# Altium project SNES TST Main.PrjPcb (part 1 of 2)
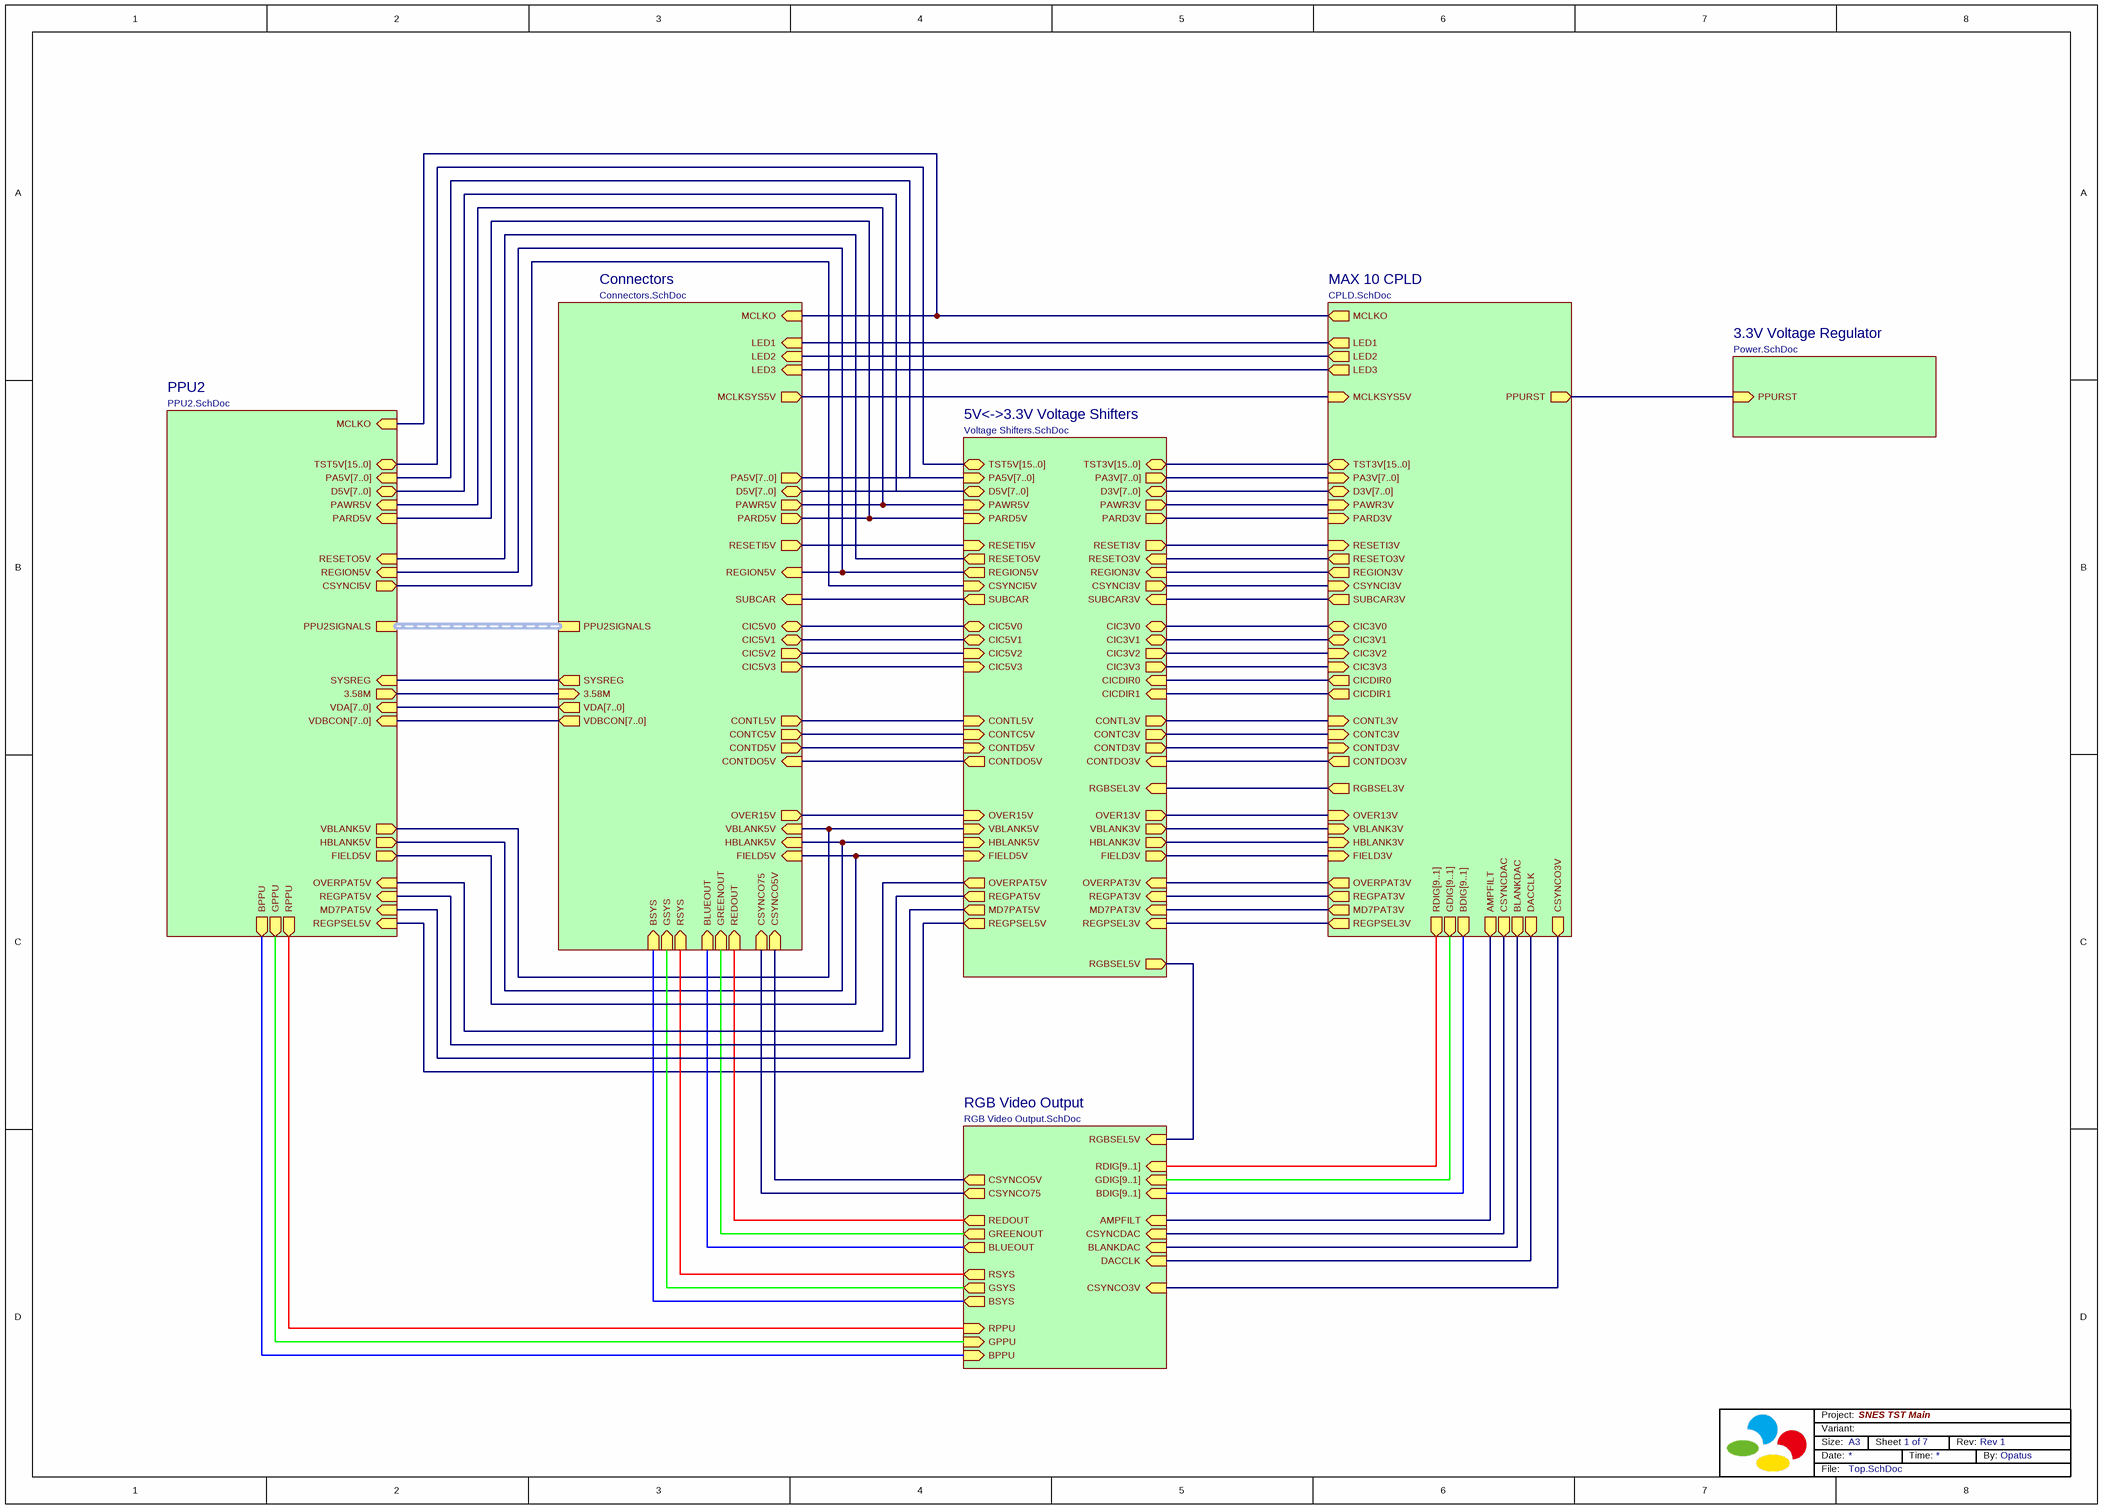
[diagram p0: Top.SchDoc]
DrawnBy: Opatus; Revision: Rev 1; Title: SNES TST Main
7 sheets, 203 parts. Net scope: hierarchical (ports join the sheet entries above them; power ports are global).
Board file: SNES TST Main.PcbDoc
Sheets:
  Top.SchDoc
    MAX 10 CPLD = CPLD.SchDoc
    3.3V Voltage Regulator = Power.SchDoc
    PPU2 = PPU2.SchDoc
    RGB Video Output = RGB Video Output.SchDoc
    5V<->3.3V Voltage Shifters = Voltage Shifters.SchDoc
    Connectors = Connectors.SchDoc

## Sheet Top.SchDoc: SNES TST Main
size A3; SheetNumber: 1; SheetTotal: 7

### Sub-sheets
3.3V Voltage Regulator = Power.SchDoc: PPURST (in)
5V<->3.3V Voltage Shifters = Voltage Shifters.SchDoc: TST5V[15..0] (bidir), D3V[7..0] (bidir), TST3V[15..0] (bidir), CSYNCI5V (in), CSYNCI3V (out), RESETI5V (in), D5V[7..0] (bidir), REGION5V (out), RESETO5V (out), RGBSEL3V (in), PA5V[7..0] (in), PA3V[7..0] (out), SUBCAR (out), RESETO3V (in), RESETI3V (out), SUBCAR3V (in), PARD3V (out), PAWR3V (out), PAWR5V (in), PARD5V (in), REGION3V (in), RGBSEL5V (out), CONTL3V (out), CONTC3V (out), CONTDO3V (in), CONTD3V (out), CIC5V3 (in), CIC5V0 (bidir), CIC5V2 (in), CIC5V1 (bidir), CIC3V3 (out), CIC3V2 (out), CIC3V0 (bidir), CIC3V1 (bidir), CICDIR1 (in), CICDIR0 (in), CONTC5V (in), CONTDO5V (out), CONTL5V (in), CONTD5V (in), OVER15V (in), FIELD5V (in), OVER13V (out), FIELD3V (out), REGPAT3V (in), REGPSEL3V (in), MD7PAT3V (in), OVERPAT3V (in), HBLANK3V (out), VBLANK3V (out), REGPAT5V (out), MD7PAT5V (out), OVERPAT5V (out), REGPSEL5V (out), VBLANK5V (in), HBLANK5V (in)
Connectors = Connectors.SchDoc: SUBCAR (in), OVER15V (out), RESETI5V (out), MCLKO (in), PPU2SIGNALS (harness PPU2), FIELD5V (in), REGION5V (in), VDBCON[7..0] (out), VDA[7..0] (out), SYSREG (out), 3.58M (in), PAWR5V (out), PARD5V (out), PA5V[7..0] (out), D5V[7..0] (bidir), MCLKSYS5V (out), LED1 (in), LED2 (in), LED3 (in), CONTL5V (out), CONTC5V (out), CONTD5V (out), CONTDO5V (in), CIC5V2 (out), CIC5V3 (out), CIC5V0 (bidir), CIC5V1 (bidir), VBLANK5V (in), HBLANK5V (in), RSYS (in), GSYS (in), BSYS (in), CSYNCO5V (in), CSYNCO75 (in), REDOUT (in), GREENOUT (in), BLUEOUT (in)
MAX 10 CPLD = CPLD.SchDoc: BDIG[9..1] (out), TST3V[15..0] (bidir), PA3V[7..0] (in), RESETI3V (in), DACCLK (out), AMPFILT (out), RESETO3V (out), MCLKO (out), CSYNCO3V (out), CSYNCDAC (out), BLANKDAC (out), CSYNCI3V (in), PAWR3V (in), PARD3V (in), PPURST (out), REGION3V (out), D3V[7..0] (bidir), GDIG[9..1] (out), RDIG[9..1] (out), SUBCAR3V (out), LED2 (out), LED3 (out), LED1 (out), MCLKSYS5V (in), VBLANK3V (in), HBLANK3V (in), FIELD3V (in), CIC3V0 (bidir), RGBSEL3V (out), CONTL3V (in), CONTC3V (in), CONTDO3V (out), CONTD3V (in), CICDIR1 (out), CICDIR0 (out), CIC3V1 (bidir), CIC3V3 (in), CIC3V2 (in), OVER13V (in), OVERPAT3V (out), MD7PAT3V (out), REGPSEL3V (out), REGPAT3V (out)
PPU2 = PPU2.SchDoc: CSYNCI5V (out), RESETO5V (in), TST5V[15..0] (bidir), RPPU (out), GPPU (out), BPPU (out), PPU2SIGNALS (harness PPU2), MCLKO (in), REGION5V (in), REGPSEL5V (in), REGPAT5V (in), OVERPAT5V (in), MD7PAT5V (in), VBLANK5V (out), HBLANK5V (out), FIELD5V (out), VDA[7..0] (in), SYSREG (in), VDBCON[7..0] (in), 3.58M (out), PAWR5V (in), PARD5V (in), PA5V[7..0] (in), D5V[7..0] (bidir)
RGB Video Output = RGB Video Output.SchDoc: GDIG[9..1] (in), BDIG[9..1] (in), RDIG[9..1] (in), AMPFILT (in), CSYNCDAC (in), BLANKDAC (in), DACCLK (in), CSYNCO3V (in), RGBSEL5V (in), CSYNCO75 (out), RPPU (in), GPPU (in), BPPU (in), CSYNCO5V (out), RSYS (out), GSYS (out), BSYS (out), GREENOUT (out), REDOUT (out), BLUEOUT (out)

### Nets
3.58M: sheet PPU2/3.58M, sheet Connectors/3.58M
AMPFILT: sheet MAX 10 CPLD/AMPFILT, sheet RGB Video Output/AMPFILT
BLANKDAC: sheet MAX 10 CPLD/BLANKDAC, sheet RGB Video Output/BLANKDAC
BLUEOUT: sheet RGB Video Output/BLUEOUT, sheet Connectors/BLUEOUT
BPPU: sheet PPU2/BPPU, sheet RGB Video Output/BPPU
BSYS: sheet RGB Video Output/BSYS, sheet Connectors/BSYS
CIC3V0: sheet MAX 10 CPLD/CIC3V0, sheet 5V<->3.3V Voltage Shifters/CIC3V0
CIC3V1: sheet MAX 10 CPLD/CIC3V1, sheet 5V<->3.3V Voltage Shifters/CIC3V1
CIC3V2: sheet MAX 10 CPLD/CIC3V2, sheet 5V<->3.3V Voltage Shifters/CIC3V2
CIC3V3: sheet MAX 10 CPLD/CIC3V3, sheet 5V<->3.3V Voltage Shifters/CIC3V3
CIC5V0: sheet 5V<->3.3V Voltage Shifters/CIC5V0, sheet Connectors/CIC5V0
CIC5V1: sheet 5V<->3.3V Voltage Shifters/CIC5V1, sheet Connectors/CIC5V1
CIC5V2: sheet 5V<->3.3V Voltage Shifters/CIC5V2, sheet Connectors/CIC5V2
CIC5V3: sheet 5V<->3.3V Voltage Shifters/CIC5V3, sheet Connectors/CIC5V3
CICDIR0: sheet MAX 10 CPLD/CICDIR0, sheet 5V<->3.3V Voltage Shifters/CICDIR0
CICDIR1: sheet MAX 10 CPLD/CICDIR1, sheet 5V<->3.3V Voltage Shifters/CICDIR1
CONTC3V: sheet MAX 10 CPLD/CONTC3V, sheet 5V<->3.3V Voltage Shifters/CONTC3V
CONTC5V: sheet 5V<->3.3V Voltage Shifters/CONTC5V, sheet Connectors/CONTC5V
CONTD3V: sheet MAX 10 CPLD/CONTD3V, sheet 5V<->3.3V Voltage Shifters/CONTD3V
CONTD5V: sheet 5V<->3.3V Voltage Shifters/CONTD5V, sheet Connectors/CONTD5V
CONTDO3V: sheet MAX 10 CPLD/CONTDO3V, sheet 5V<->3.3V Voltage Shifters/CONTDO3V
CONTDO5V: sheet 5V<->3.3V Voltage Shifters/CONTDO5V, sheet Connectors/CONTDO5V
CONTL3V: sheet MAX 10 CPLD/CONTL3V, sheet 5V<->3.3V Voltage Shifters/CONTL3V
CONTL5V: sheet 5V<->3.3V Voltage Shifters/CONTL5V, sheet Connectors/CONTL5V
CSYNCDAC: sheet MAX 10 CPLD/CSYNCDAC, sheet RGB Video Output/CSYNCDAC
CSYNCI3V: sheet MAX 10 CPLD/CSYNCI3V, sheet 5V<->3.3V Voltage Shifters/CSYNCI3V
CSYNCI5V: sheet PPU2/CSYNCI5V, sheet 5V<->3.3V Voltage Shifters/CSYNCI5V
CSYNCO3V: sheet MAX 10 CPLD/CSYNCO3V, sheet RGB Video Output/CSYNCO3V
CSYNCO5V: sheet RGB Video Output/CSYNCO5V, sheet Connectors/CSYNCO5V
CSYNCO75: sheet RGB Video Output/CSYNCO75, sheet Connectors/CSYNCO75
DACCLK: sheet MAX 10 CPLD/DACCLK, sheet RGB Video Output/DACCLK
FIELD3V: sheet MAX 10 CPLD/FIELD3V, sheet 5V<->3.3V Voltage Shifters/FIELD3V
FIELD5V: sheet PPU2/FIELD5V, sheet 5V<->3.3V Voltage Shifters/FIELD5V, sheet Connectors/FIELD5V
GPPU: sheet PPU2/GPPU, sheet RGB Video Output/GPPU
GREENOUT: sheet RGB Video Output/GREENOUT, sheet Connectors/GREENOUT
GSYS: sheet RGB Video Output/GSYS, sheet Connectors/GSYS
HBLANK3V: sheet MAX 10 CPLD/HBLANK3V, sheet 5V<->3.3V Voltage Shifters/HBLANK3V
HBLANK5V: sheet PPU2/HBLANK5V, sheet 5V<->3.3V Voltage Shifters/HBLANK5V, sheet Connectors/HBLANK5V
LED1: sheet MAX 10 CPLD/LED1, sheet Connectors/LED1
LED2: sheet MAX 10 CPLD/LED2, sheet Connectors/LED2
LED3: sheet MAX 10 CPLD/LED3, sheet Connectors/LED3
MCLKO: sheet MAX 10 CPLD/MCLKO, sheet PPU2/MCLKO, sheet Connectors/MCLKO
MCLKSYS5V: sheet MAX 10 CPLD/MCLKSYS5V, sheet Connectors/MCLKSYS5V
MD7PAT3V: sheet MAX 10 CPLD/MD7PAT3V, sheet 5V<->3.3V Voltage Shifters/MD7PAT3V
MD7PAT5V: sheet PPU2/MD7PAT5V, sheet 5V<->3.3V Voltage Shifters/MD7PAT5V
OVER13V: sheet MAX 10 CPLD/OVER13V, sheet 5V<->3.3V Voltage Shifters/OVER13V
OVER15V: sheet 5V<->3.3V Voltage Shifters/OVER15V, sheet Connectors/OVER15V
OVERPAT3V: sheet MAX 10 CPLD/OVERPAT3V, sheet 5V<->3.3V Voltage Shifters/OVERPAT3V
OVERPAT5V: sheet PPU2/OVERPAT5V, sheet 5V<->3.3V Voltage Shifters/OVERPAT5V
PARD3V: sheet MAX 10 CPLD/PARD3V, sheet 5V<->3.3V Voltage Shifters/PARD3V
PARD5V: sheet PPU2/PARD5V, sheet 5V<->3.3V Voltage Shifters/PARD5V, sheet Connectors/PARD5V
PAWR3V: sheet MAX 10 CPLD/PAWR3V, sheet 5V<->3.3V Voltage Shifters/PAWR3V
PAWR5V: sheet PPU2/PAWR5V, sheet 5V<->3.3V Voltage Shifters/PAWR5V, sheet Connectors/PAWR5V
PPURST: sheet MAX 10 CPLD/PPURST, sheet 3.3V Voltage Regulator/PPURST
REDOUT: sheet RGB Video Output/REDOUT, sheet Connectors/REDOUT
REGION3V: sheet MAX 10 CPLD/REGION3V, sheet 5V<->3.3V Voltage Shifters/REGION3V
REGION5V: sheet PPU2/REGION5V, sheet 5V<->3.3V Voltage Shifters/REGION5V, sheet Connectors/REGION5V
REGPAT3V: sheet MAX 10 CPLD/REGPAT3V, sheet 5V<->3.3V Voltage Shifters/REGPAT3V
REGPAT5V: sheet PPU2/REGPAT5V, sheet 5V<->3.3V Voltage Shifters/REGPAT5V
REGPSEL3V: sheet MAX 10 CPLD/REGPSEL3V, sheet 5V<->3.3V Voltage Shifters/REGPSEL3V
REGPSEL5V: sheet PPU2/REGPSEL5V, sheet 5V<->3.3V Voltage Shifters/REGPSEL5V
RESETI3V: sheet MAX 10 CPLD/RESETI3V, sheet 5V<->3.3V Voltage Shifters/RESETI3V
RESETI5V: sheet 5V<->3.3V Voltage Shifters/RESETI5V, sheet Connectors/RESETI5V
RESETO3V: sheet MAX 10 CPLD/RESETO3V, sheet 5V<->3.3V Voltage Shifters/RESETO3V
RESETO5V: sheet PPU2/RESETO5V, sheet 5V<->3.3V Voltage Shifters/RESETO5V
RGBSEL3V: sheet MAX 10 CPLD/RGBSEL3V, sheet 5V<->3.3V Voltage Shifters/RGBSEL3V
RGBSEL5V: sheet RGB Video Output/RGBSEL5V, sheet 5V<->3.3V Voltage Shifters/RGBSEL5V
RPPU: sheet PPU2/RPPU, sheet RGB Video Output/RPPU
RSYS: sheet RGB Video Output/RSYS, sheet Connectors/RSYS
SUBCAR: sheet 5V<->3.3V Voltage Shifters/SUBCAR, sheet Connectors/SUBCAR
SUBCAR3V: sheet MAX 10 CPLD/SUBCAR3V, sheet 5V<->3.3V Voltage Shifters/SUBCAR3V
SYSREG: sheet PPU2/SYSREG, sheet Connectors/SYSREG
VBLANK3V: sheet MAX 10 CPLD/VBLANK3V, sheet 5V<->3.3V Voltage Shifters/VBLANK3V
VBLANK5V: sheet PPU2/VBLANK5V, sheet 5V<->3.3V Voltage Shifters/VBLANK5V, sheet Connectors/VBLANK5V

### Buses and harness runs
bus sheet 5V<->3.3V Voltage Shifters/D3V[7..0] = sheet MAX 10 CPLD/D3V[7..0]
bus sheet 5V<->3.3V Voltage Shifters/D5V[7..0] = sheet Connectors/D5V[7..0] = sheet PPU2/D5V[7..0]
bus sheet 5V<->3.3V Voltage Shifters/PA3V[7..0] = sheet MAX 10 CPLD/PA3V[7..0]
bus sheet 5V<->3.3V Voltage Shifters/PA5V[7..0] = sheet Connectors/PA5V[7..0] = sheet PPU2/PA5V[7..0]
bus sheet 5V<->3.3V Voltage Shifters/TST3V[15..0] = sheet MAX 10 CPLD/TST3V[15..0]
bus sheet 5V<->3.3V Voltage Shifters/TST5V[15..0] = sheet PPU2/TST5V[15..0]
bus sheet Connectors/VDA[7..0] = sheet PPU2/VDA[7..0]
bus sheet Connectors/VDBCON[7..0] = sheet PPU2/VDBCON[7..0]
bus sheet MAX 10 CPLD/BDIG[9..1] = sheet RGB Video Output/BDIG[9..1]
bus sheet MAX 10 CPLD/GDIG[9..1] = sheet RGB Video Output/GDIG[9..1]
bus sheet MAX 10 CPLD/RDIG[9..1] = sheet RGB Video Output/RDIG[9..1]
harness sheet Connectors/PPU2SIGNALS = sheet PPU2/PPU2SIGNALS

### Notes on the sheet
- Size:
- Date:
- Variant:
- Project:
- A3
- Sheet
- Time:
- Rev:
- By:
- File:

## Sheet CPLD.SchDoc: SNES TST Main
size A4; DocumentNumber: 1; SheetNumber: 2; SheetTotal: 7
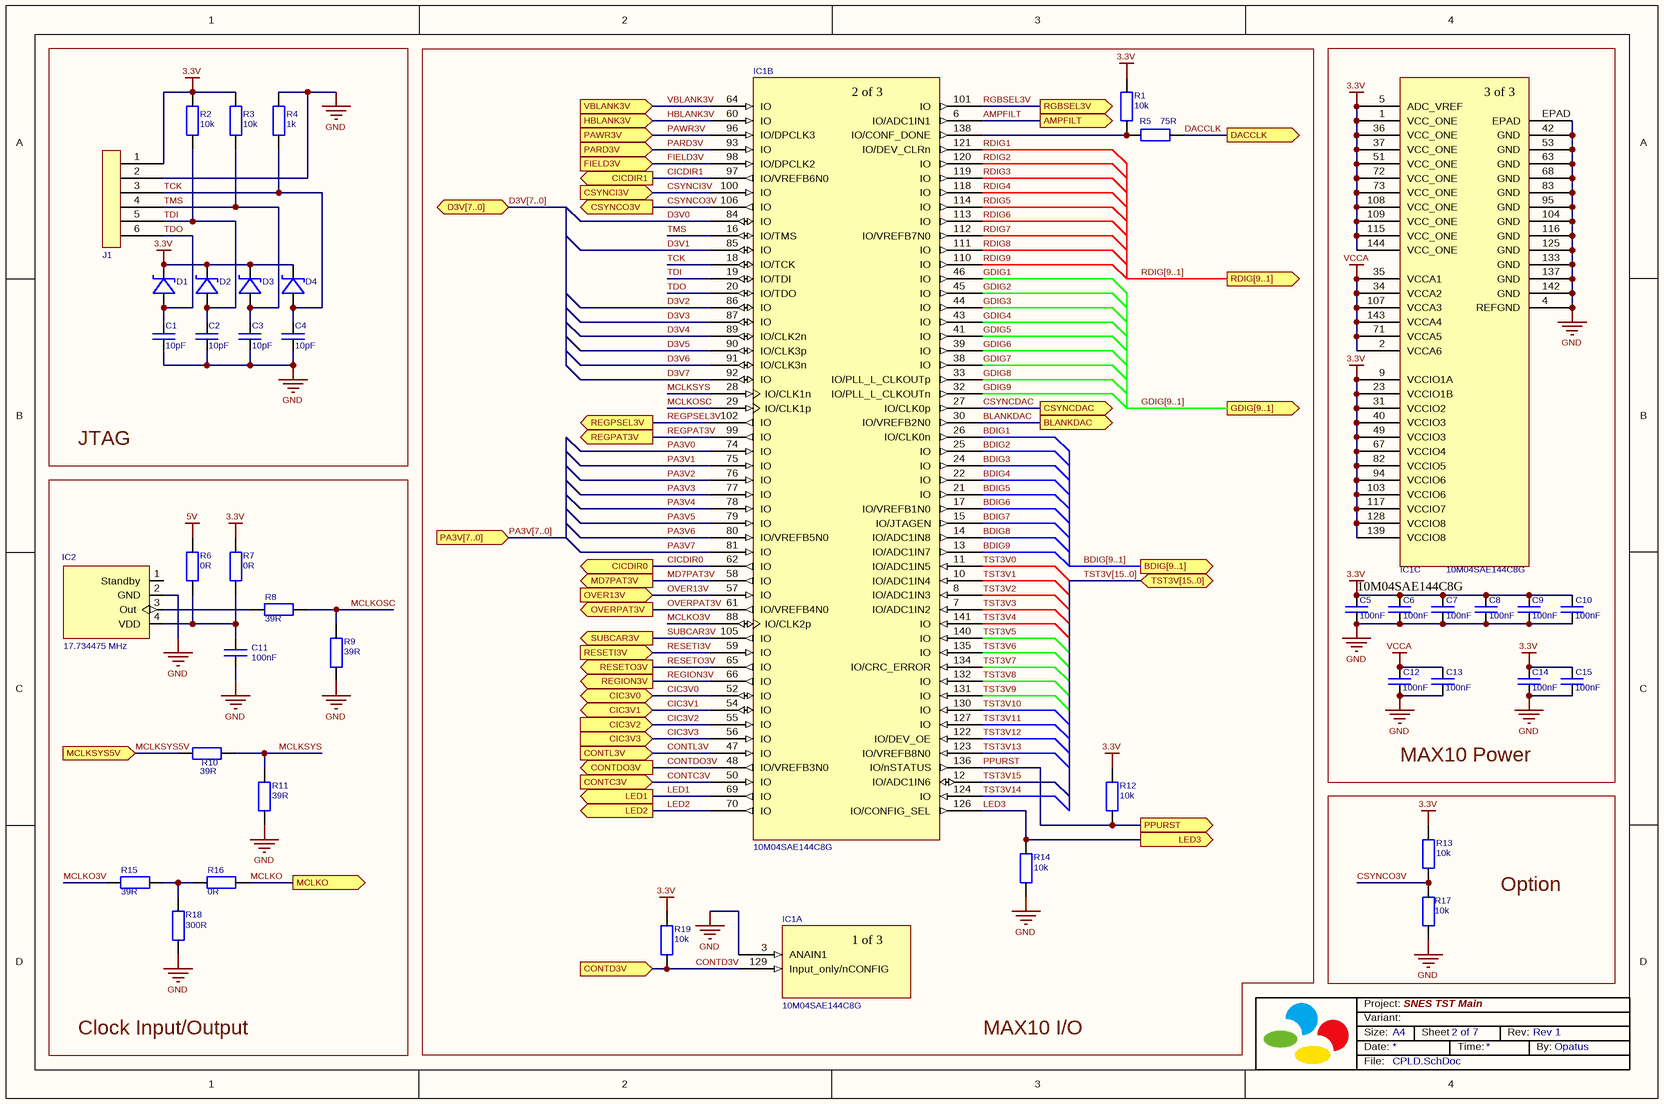
[diagram p1: CPLD.SchDoc]

### Parts
C1  value 10pF  [Cap_0402_Chip]  (hidden comment: Ceramic Capacitor 10pF 10V ±20% X7R 0402)
C2  value 10pF  [Cap_0402_Chip]  (hidden comment: Ceramic Capacitor 10pF 10V ±20% X7R 0402)
C3  value 10pF  [Cap_0402_Chip]  (hidden comment: Ceramic Capacitor 10pF 10V ±20% X7R 0402)
C4  value 10pF  [Cap_0402_Chip]  (hidden comment: Ceramic Capacitor 10pF 10V ±20% X7R 0402)
C5  value 100nF  [Cap_0402_Chip]  (hidden comment: Ceramic Capacitor 100nF 10V ±20% X7R 0402)
C6  value 100nF  [Cap_0402_Chip]  (hidden comment: Ceramic Capacitor 100nF 10V ±20% X7R 0402)
C7  value 100nF  [Cap_0402_Chip]  (hidden comment: Ceramic Capacitor 100nF 10V ±20% X7R 0402)
C8  value 100nF  [Cap_0402_Chip]  (hidden comment: Ceramic Capacitor 100nF 10V ±20% X7R 0402)
C9  value 100nF  [Cap_0402_Chip]  (hidden comment: Ceramic Capacitor 100nF 10V ±20% X7R 0402)
C10  value 100nF  [Cap_0402_Chip]  (hidden comment: Ceramic Capacitor 100nF 10V ±20% X7R 0402)
C11  value 100nF  [Cap_0402_Chip]  (hidden comment: Ceramic Capacitor 100nF 10V ±20% X7R 0402)
C12  value 100nF  [Cap_0402_Chip]  (hidden comment: Ceramic Capacitor 100nF 10V ±20% X7R 0402)
C13  value 100nF  [Cap_0402_Chip]  (hidden comment: Ceramic Capacitor 100nF 10V ±20% X7R 0402)
C14  value 100nF  [Cap_0402_Chip]  (hidden comment: Ceramic Capacitor 100nF 10V ±20% X7R 0402)
C15  value 100nF  [Cap_0402_Chip]  (hidden comment: Ceramic Capacitor 100nF 10V ±20% X7R 0402)
D1  BAT54WS  [SOD323]  (value not drawn)
D2  BAT54WS  [SOD323]  (value not drawn)
D3  BAT54WS  [SOD323]  (value not drawn)
D4  BAT54WS  [SOD323]  (value not drawn)
IC1  10M04SAE144C8G  [EQFP-144_A:1P65_]  (parts A,B,C of 3)
IC2  17.734475 MHz  [Quarz 7.5mm]
J1  Conn 6P  [Con6P]  (value not drawn)  (no BOM)
R1  value 10k  [Res_0402_Chip]  (hidden comment: Resistor 10k 0402 ±1%)
R2  value 10k  [Res_0402_Chip]  (hidden comment: Resistor 10k 0402 ±1%)
R3  value 10k  [Res_0402_Chip]  (hidden comment: Resistor 10k 0402 ±1%)
R4  value 1k  [Res_0402_Chip]  (hidden comment: Resistor 1k 0402 ±1%)
R5  value 75R  [Res_0402_Chip]  (hidden comment: Resistor 75R 0402 ±1%)
R6  value 0R  [Res_0402_Chip]  (hidden comment: Resistor 0R 0402)
R7  value 0R  [Res_0402_Chip]  (hidden comment: Resistor 0R 0402)
R8  value 39R  [Res_0603_Chip]  (hidden comment: Resistor 39R 0603 ±1%)
R9  value 39R  [Res_0603_Chip]  (hidden comment: Resistor 39R 0603 ±1%)
R10  value 39R  [Res_0603_Chip]  (hidden comment: Resistor 39R 0603 ±1%)
R11  value 39R  [Res_0603_Chip]  (hidden comment: Resistor 39R 0603 ±1%)
R12  value 10k  [Res_0402_Chip]  (hidden comment: Resistor 10k 0402 ±1%)
R13  value 10k  [Res_0402_Chip]  (hidden comment: Resistor 10k 0402 ±1%)
R14  value 10k  [Res_0402_Chip]  (hidden comment: Resistor 10k 0402 ±1%)
R15  value 39R  [Res_0603_Chip]  (hidden comment: Resistor 39R 0603 ±1%)
R16  value 0R  [Res_0603_Chip]  (hidden comment: Resistor 0R 0603)
R17  value 10k  [Res_0402_Chip]  (hidden comment: Resistor 10k 0402 ±1%)
R18  value 300R  [Res_0603_Chip]  (hidden comment: Resistor 300R 0603 ±1%)
R19  value 10k  [Res_0402_Chip]  (hidden comment: Resistor 10k 0402 ±1%)

### Blocks framed on the sheet
JTAG: C1-C4 D1-D4 J1 R2-R4
MAX10 I/O: IC1 R1 R5 R12 R14 R19
MAX10 Power: C5-C10 C12-C15 IC1
Clock Input/Output: C11 IC2 R6-R11 R15 R16 R18
Option: R13 R17

### Ports
AMPFILT (out), BDIG[9..1] (out), BLANKDAC (out), CIC3V0 (bidir), CIC3V1 (bidir), CIC3V2 (in), CIC3V3 (in), CICDIR0 (out), CICDIR1 (out), CONTC3V (in), CONTD3V (in), CONTDO3V (out), CONTL3V (in), CSYNCDAC (out), CSYNCI3V (in), CSYNCO3V (out), D3V[7..0] (bidir), DACCLK (out), FIELD3V (in), GDIG[9..1] (out), HBLANK3V (in), LED1 (out), LED2 (out), LED3 (out), MCLKO (out), MCLKSYS5V (in), MD7PAT3V (out), OVER13V (in), OVERPAT3V (out), PA3V[7..0] (in), PARD3V (in), PAWR3V (in), PPURST (out), RDIG[9..1] (out), REGION3V (out), REGPAT3V (out), REGPSEL3V (out), RESETI3V (in), RESETO3V (out), RGBSEL3V (out), SUBCAR3V (out), TST3V[15..0] (bidir), VBLANK3V (in)

### Nets
3.3V: C5.1 C6.1 C7.1 C8.1 C9.1 C10.1 C14.1 C15.1 D1.1(K) D2.1(K) D3.1(K) D4.1(K) IC1.1(VCC_ONE) IC1.5(ADC_VREF) IC1.9(VCCIO1A) IC1.23(VCCIO1B) IC1.31(VCCIO2) IC1.36(VCC_ONE) IC1.37(VCC_ONE) IC1.40(VCCIO3) IC1.49(VCCIO3) IC1.51(VCC_ONE) IC1.67(VCCIO4) IC1.72(VCC_ONE) IC1.73(VCC_ONE) IC1.82(VCCIO5) IC1.94(VCCIO6) IC1.103(VCCIO6) IC1.108(VCC_ONE) IC1.109(VCC_ONE) IC1.115(VCC_ONE) IC1.117(VCCIO7) IC1.128(VCCIO8) IC1.139(VCCIO8) IC1.144(VCC_ONE) J1.1 R1.1 R2.1 R3.1 R7.1 R12.1 R13.1 R19.1
5V: R6.1
GND: C1.2 C2.2 C3.2 C4.2 C5.2 C6.2 C7.2 C8.2 C9.2 C10.2 C11.2 C12.2 C13.2 C14.2 C15.2 IC1.3(ANAIN1) IC1.4(REFGND) IC1.42(GND) IC1.53(GND) IC1.63(GND) IC1.68(GND) IC1.83(GND) IC1.95(GND) IC1.104(GND) IC1.116(GND) IC1.125(GND) IC1.133(GND) IC1.137(GND) IC1.142(GND) IC1.EPAD IC2.2(GND) J1.2 R4.2 R9.2 R11.2 R14.1 R17.2 R18.2
VCCA: C12.1 C13.1 IC1.2(VCCA6) IC1.34(VCCA2) IC1.35(VCCA1) IC1.71(VCCA5) IC1.107(VCCA3) IC1.143(VCCA4)
AMPFILT: IC1.6(IO/ADC1IN1) ; port AMPFILT
BDIG1: IC1.26(IO/CLK0n)
BDIG2: IC1.25(IO)
BDIG3: IC1.24(IO)
BDIG4: IC1.22(IO)
BDIG5: IC1.21(IO)
BDIG6: IC1.17(IO/VREFB1N0)
BDIG7: IC1.15(IO/JTAGEN)
BDIG8: IC1.14(IO/ADC1IN8)
BDIG9: IC1.13(IO/ADC1IN7)
BLANKDAC: IC1.30(IO/VREFB2N0) ; port BLANKDAC
CIC3V0: IC1.52(IO) ; port CIC3V0
CIC3V1: IC1.54(IO) ; port CIC3V1
CIC3V2: IC1.55(IO) ; port CIC3V2
CIC3V3: IC1.56(IO) ; port CIC3V3
CICDIR0: IC1.62(IO) ; port CICDIR0
CICDIR1: IC1.97(IO/VREFB6N0) ; port CICDIR1
CONTC3V: IC1.50(IO) ; port CONTC3V
CONTD3V: IC1.129(Input_only/nCONFIG) R19.2 ; port CONTD3V
CONTDO3V: IC1.48(IO/VREFB3N0) ; port CONTDO3V
CONTL3V: IC1.47(IO) ; port CONTL3V
CSYNCDAC: IC1.27(IO/CLK0p) ; port CSYNCDAC
CSYNCI3V: IC1.100(IO) ; port CSYNCI3V
CSYNCO3V: IC1.106(IO) R13.2 R17.1 ; port CSYNCO3V
D3V0: IC1.84(IO)
D3V1: IC1.85(IO)
D3V2: IC1.86(IO)
D3V3: IC1.87(IO)
D3V4: IC1.89(IO/CLK2n)
D3V5: IC1.90(IO/CLK3p)
D3V6: IC1.91(IO/CLK3n)
D3V7: IC1.92(IO)
DACCLK: R5.2 ; port DACCLK
FIELD3V: IC1.98(IO/DPCLK2) ; port FIELD3V
GDIG1: IC1.46(IO)
GDIG2: IC1.45(IO)
GDIG3: IC1.44(IO)
GDIG4: IC1.43(IO)
GDIG5: IC1.41(IO)
GDIG6: IC1.39(IO)
GDIG7: IC1.38(IO)
GDIG8: IC1.33(IO/PLL_L_CLKOUTp)
GDIG9: IC1.32(IO/PLL_L_CLKOUTn)
HBLANK3V: IC1.60(IO) ; port HBLANK3V
LED1: IC1.69(IO) ; port LED1
LED2: IC1.70(IO) ; port LED2
LED3: IC1.126(IO/CONFIG_SEL) R14.2 ; port LED3
MCLKO: R16.1 ; port MCLKO
MCLKO3V: IC1.88(IO/CLK2p) R15.2
MCLKOSC: IC1.29(IO/CLK1p) R8.1 R9.1
MCLKSYS: IC1.28(IO/CLK1n) R10.1 R11.1
MCLKSYS5V: R10.2 ; port MCLKSYS5V
MD7PAT3V: IC1.58(IO) ; port MD7PAT3V
OVER13V: IC1.57(IO) ; port OVER13V
OVERPAT3V: IC1.61(IO/VREFB4N0) ; port OVERPAT3V
PA3V0: IC1.74(IO)
PA3V1: IC1.75(IO)
PA3V2: IC1.76(IO)
PA3V3: IC1.77(IO)
PA3V4: IC1.78(IO)
PA3V5: IC1.79(IO)
PA3V6: IC1.80(IO/VREFB5N0)
PA3V7: IC1.81(IO)
PARD3V: IC1.93(IO) ; port PARD3V
PAWR3V: IC1.96(IO/DPCLK3) ; port PAWR3V
PPURST: IC1.136(IO/nSTATUS) R12.2 ; port PPURST
RDIG1: IC1.121(IO/DEV_CLRn)
RDIG2: IC1.120(IO)
RDIG3: IC1.119(IO)
RDIG4: IC1.118(IO)
RDIG5: IC1.114(IO)
RDIG6: IC1.113(IO)
RDIG7: IC1.112(IO/VREFB7N0)
RDIG8: IC1.111(IO)
RDIG9: IC1.110(IO)
REGION3V: IC1.66(IO) ; port REGION3V
REGPAT3V: IC1.99(IO) ; port REGPAT3V
REGPSEL3V: IC1.102(IO) ; port REGPSEL3V
RESETI3V: IC1.59(IO) ; port RESETI3V
RESETO3V: IC1.65(IO) ; port RESETO3V
RGBSEL3V: IC1.101(IO) ; port RGBSEL3V
SUBCAR3V: IC1.105(IO) ; port SUBCAR3V
TCK: C4.1 D4.2(A) IC1.18(IO/TCK) J1.3 R4.1
TDI: C2.1 D2.2(A) IC1.19(IO/TDI) J1.5 R2.2
TDO: C1.1 D1.2(A) IC1.20(IO/TDO) J1.6
TMS: C3.1 D3.2(A) IC1.16(IO/TMS) J1.4 R3.2
TST3V0: IC1.11(IO/ADC1IN5)
TST3V1: IC1.10(IO/ADC1IN4)
TST3V2: IC1.8(IO/ADC1IN3)
TST3V3: IC1.7(IO/ADC1IN2)
TST3V4: IC1.141(IO)
TST3V5: IC1.140(IO)
TST3V6: IC1.135(IO)
TST3V7: IC1.134(IO/CRC_ERROR)
TST3V8: IC1.132(IO)
TST3V9: IC1.131(IO)
TST3V10: IC1.130(IO)
TST3V11: IC1.127(IO)
TST3V12: IC1.122(IO/DEV_OE)
TST3V13: IC1.123(IO/VREFB8N0)
TST3V14: IC1.124(IO)
TST3V15: IC1.12(IO/ADC1IN6)
VBLANK3V: IC1.64(IO) ; port VBLANK3V
NetC11_1: C11.1 IC2.4(VDD) R6.2 R7.2
NetIC1_138: IC1.138(IO/CONF_DONE) R1.2 R5.1
NetIC2_3: IC2.3(Out) R8.2
NetR15_1: R15.1 R16.2 R18.1

Not connected (* = marked no-connect by the designer): IC2 1(Standby)

### Buses and harness runs
bus BDIG[9..1] = port BDIG[9..1]
bus D3V[7..0] = port D3V[7..0]
bus GDIG[9..1] = port GDIG[9..1]
bus PA3V[7..0] = port PA3V[7..0]
bus RDIG[9..1] = port RDIG[9..1]
bus TST3V[15..0] = port TST3V[15..0]

### Notes on the sheet
- Size:
- Date:
- Variant:
- Project:
- A4
- Sheet
- Time:
- Rev:
- By:
- File:
- (in symbol 10M08SAE144C8G, part A) 1 of 3
- (in symbol 10M08SAE144C8G, part B) 2 of 3
- (in symbol 10M08SAE144C8G, part C) 3 of 3

### Library data of the parts
C1-C15 = Capacitor: ChipSize: 0402; NominalVoltage: 10V; Dielectric: X7R; Tolerance: ±20%; PartType: Ceramic Capacitor
D1-D4 = Schottky Diode: Manufacturer_Part_Number: BAT54WS-7-F; Manufacturer: Diodes
IC1 = 10M08SAE144C8G: No Description Available; Manufacturer: Intel; SourceLibrary: Intel_2020-01-10; Built_By: EMA_Cory; Copyright: Copyright (C) 2018 Accelerated Designs. All rights reserved; Manufacturer_Part_Number: 10M04SAE144C8G; RefDes: RefDes; Type: DEV
IC2 = Oscillator: Manufacturer: IQD Frequency; Manufacturer_Part_Number: LFSPXO020648Bulk; Frequency: 17.734475 MHz
J1 = Conn 6P: 6 Pole Connector
R1-R7 R12-R14 R17 R19 = R: ChipSize: 0402; PartType: Resistor
  R1-R5 R12-R14 R17 R19: Tolerance: ±1%
R8-R11 R15 R16 R18 = R: ChipSize: 0603; PartType: Resistor
  R8-R11 R15 R18: Tolerance: ±1%

## Sheet Power.SchDoc: SNES TST Main
size A4; SheetNumber: 7; SheetTotal: 7
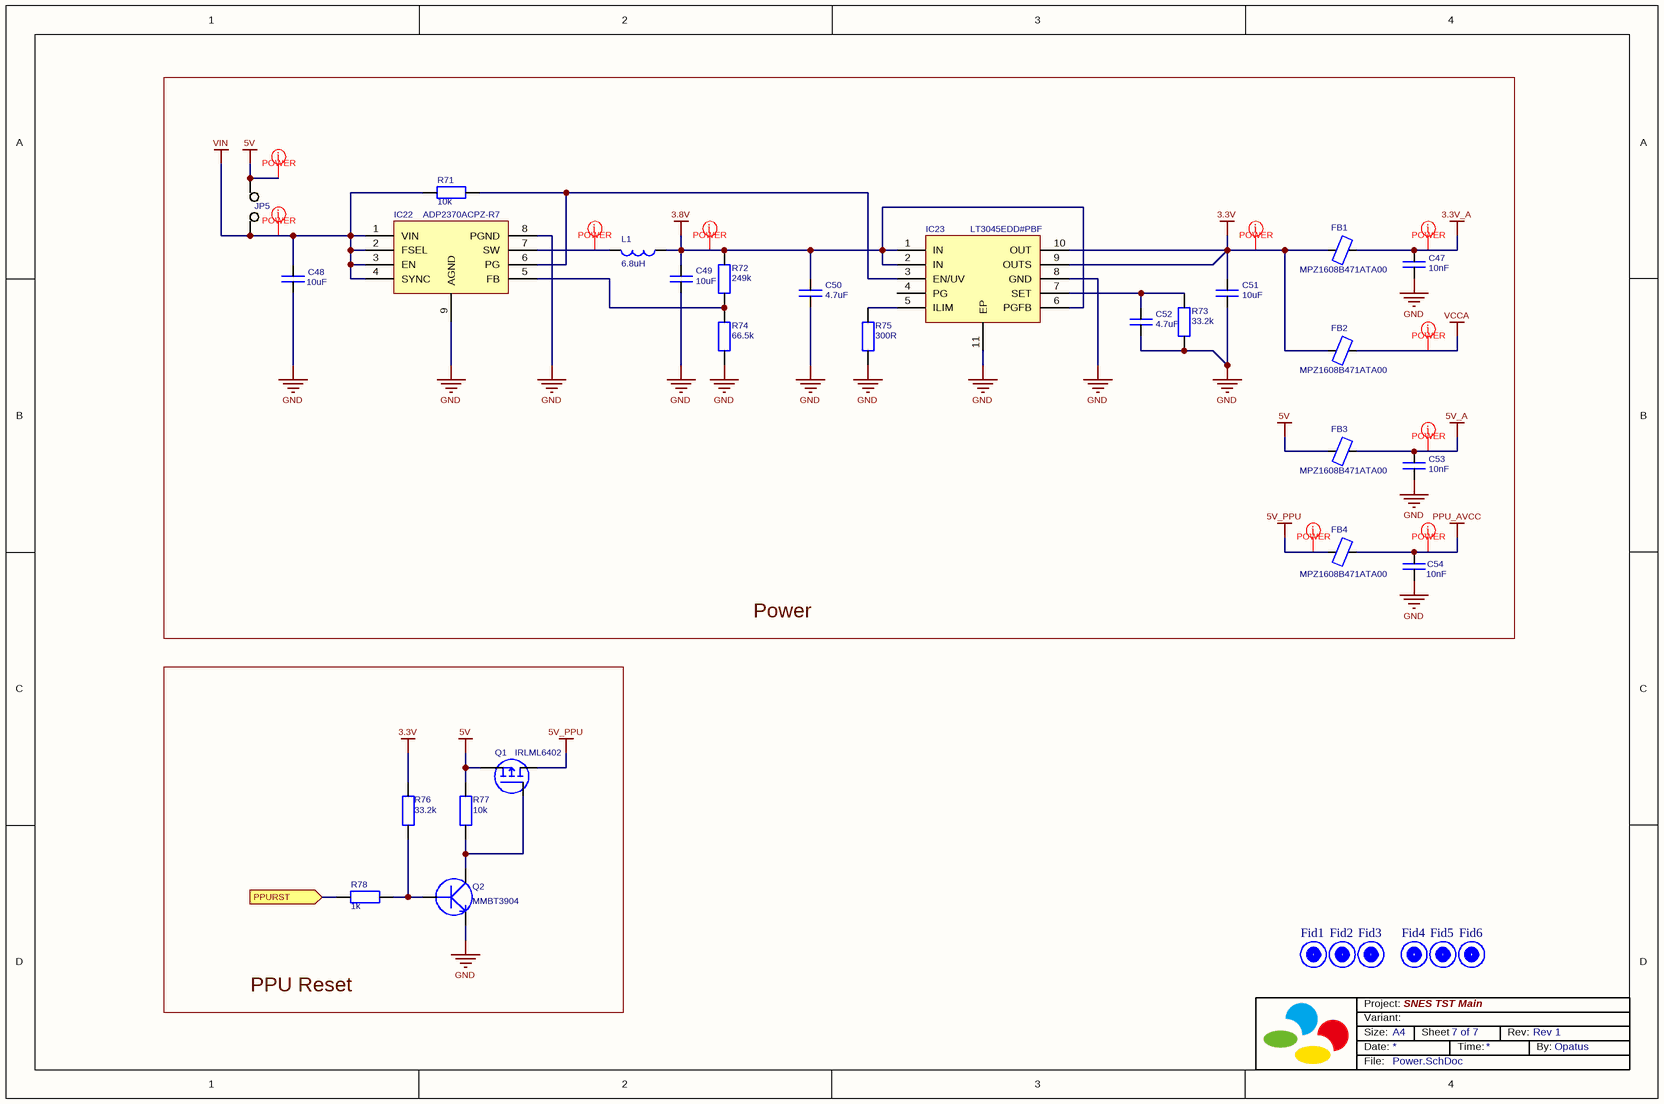
[diagram p2: Power.SchDoc]

### Parts
C47  value 10nF  [Cap_0402_Chip]  (hidden comment: Ceramic Capacitor 10nF 10V ±20% X7R 0402)
C48  value 10uF  [Cap_0805_Chip]  (hidden comment: Ceramic Capacitor 10uF 25V ±20% X5R 0805)
C49  value 10uF  [Cap_0603_Chip]  (hidden comment: Ceramic Capacitor 10uF 10V ±20% X5R 0603)
C50  value 4.7uF  [Cap_0603_Chip]  (hidden comment: Ceramic Capacitor 4.7uF 10V ±20% X5R 0603)
C51  value 10uF  [Cap_0603_Chip]  (hidden comment: Ceramic Capacitor 10uF 10V ±20% X5R 0603)
C52  value 4.7uF  [Cap_0603_Chip]  (hidden comment: Ceramic Capacitor 4.7uF 10V ±20% X5R 0603)
C53  value 10nF  [Cap_0402_Chip]  (hidden comment: Ceramic Capacitor 10nF 10V ±20% X7R 0402)
C54  value 10nF  [Cap_0402_Chip]  (hidden comment: Ceramic Capacitor 10nF 10V ±20% X7R 0402)
FB1  Manufacturer_Part_Number: MPZ1608B471ATA00  [Ind_0603_Chip]  (hidden comment: 470Ohm  1A)
FB2  Manufacturer_Part_Number: MPZ1608B471ATA00  [Ind_0603_Chip]  (hidden comment: 470Ohm  1A)
FB3  Manufacturer_Part_Number: MPZ1608B471ATA00  [Ind_0603_Chip]  (hidden comment: 470Ohm  1A)
FB4  Manufacturer_Part_Number: MPZ1608B471ATA00  [Ind_0603_Chip]  (hidden comment: 470Ohm  1A)
Fid1  Fiducial  [Fiducial_1_side]  (value not drawn)  (no BOM)
Fid2  Fiducial  [Fiducial_1_side]  (value not drawn)  (no BOM)
Fid3  Fiducial  [Fiducial_1_side]  (value not drawn)  (no BOM)
Fid4  Fiducial  [Fiducial_1_side]  (value not drawn)  (no BOM)
Fid5  Fiducial  [Fiducial_1_side]  (value not drawn)  (no BOM)
Fid6  Fiducial  [Fiducial_1_side]  (value not drawn)  (no BOM)
IC22  Manufacturer_Part_Number: ADP2370ACPZ-R7  [LFCSP8]  (hidden comment: ADP2370)
IC23  Manufacturer_Part_Number: LT3045EDD#PBF  [DFN10]  (hidden comment: LT3045)
JP5  Jumper  [Jumper Big]  (value not drawn)  (no BOM)
L1  value 6.8uH  [WE-MAPI_3020]  (hidden comment: 0603)
Q1  IRLML6402  [SOT23_FET]
Q2  MMBT3904  [SOT23_Transistor]
R71  value 10k  [Res_0402_Chip]  (hidden comment: Resistor 10k 0402 ±1%)
R72  value 249k  [Res_0402_Chip]  (hidden comment: Resistor 249k 0402 ±1%)
R73  value 33.2k  [Res_0402_Chip]  (hidden comment: Resistor 33.2k 0402 ±1%)
R74  value 66.5k  [Res_0402_Chip]  (hidden comment: Resistor 66.5k 0402 ±1%)
R75  value 300R  [Res_0402_Chip]  (hidden comment: Resistor 300R 0402 ±1%)
R76  value 33.2k  [Res_0402_Chip]  (hidden comment: Resistor 33.2k 0402 ±1%)
R77  value 10k  [Res_0402_Chip]  (hidden comment: Resistor 10k 0402 ±1%)
R78  value 1k  [Res_0402_Chip]  (hidden comment: Resistor 1k 0402 ±1%)

### Blocks framed on the sheet
Power: C47-C54 FB1-FB4 IC22 IC23 JP5 L1 R71-R75
PPU Reset: Q1 Q2 R76-R78

### Ports
PPURST (in)

### Nets
3.3V: C51.2 FB1.1 FB2.1 IC23.9(OUTS) IC23.10(OUT) R76.2
3.3V_A: C47.1 FB1.2
3.8V: C49.2 C50.2 IC23.1(IN) IC23.2(IN) IC23.6(PGFB) L1.2 R72.1
5V: FB3.1 JP5.1 Q1.S R77.1
5V_A: C53.1 FB3.2
5V_PPU: FB4.1 Q1.D
GND: C47.2 C48.1 C49.1 C50.1 C51.1 C52.1 C53.2 C54.2 IC22.8(PGND) IC22.9(AGND) IC23.8(GND) IC23.11(EP) Q2.E R73.2 R74.2 R75.2
PPU_AVCC: C54.1 FB4.2
VCCA: FB2.2
VIN: C48.2 IC22.1(VIN) IC22.2(FSEL) IC22.3(EN) IC22.4(SYNC) JP5.2 R71.1
PPURST: R78.1 ; port PPURST
NetC52_2: C52.2 IC23.7(SET) R73.1
NetIC22_5: IC22.5(FB) R72.2 R74.1
NetIC22_6: IC22.6(PG) IC23.3(EN/UV) R71.2
NetIC22_7: IC22.7(SW) L1.1
NetIC23_5: IC23.5(ILIM) R75.1
NetQ1_G: Q1.G Q2.C R77.2
NetQ2_B: Q2.B R76.1 R78.2

Not connected (* = marked no-connect by the designer): IC23 4(PG)

### Layout directives
net class POWER: 3.3V, 3.3V_A, 3.8V, 5V, 5V_A, 5V_PPU, NetIC22_7, PPU_AVCC, VCCA, VIN

### Notes on the sheet
- Size:
- Date:
- Variant:
- Project:
- A4
- Sheet
- Time:
- Rev:
- By:
- File:

### Library data of the parts
C47 C53 C54 = Capacitor: ChipSize: 0402; NominalVoltage: 10V; Dielectric: X7R; Tolerance: ±20%; PartType: Ceramic Capacitor
C48 = Capacitor: ChipSize: 0805; NominalVoltage: 25V; Dielectric: X5R; Tolerance: ±20%; PartType: Ceramic Capacitor
C49-C52 = Capacitor: ChipSize: 0603; NominalVoltage: 10V; Dielectric: X5R; Tolerance: ±20%; PartType: Ceramic Capacitor
FB1-FB4 = Ferrite Bead: Manufacturer: TDK; Value: 470Ohm  1A
IC22 = ADP2370: SMPS; Manufacturer: Analog Devices Inc
IC23 = LT3045: LDO; Manufacturer: Analog Devices Inc
L1 = L: Manufacturer: Würth; Manufacturer_Part_Number: 74438336068
Q1 = Mosfet1: Manufacturer: Diodes; Manufacturer_Part_Number: IRLML6402
Q2 = T_NPN: Manufacturer: Diodes; Manufacturer_Part_Number: MMBT3904
R71-R78 = R: ChipSize: 0402; Tolerance: ±1%; PartType: Resistor

## Sheet PPU2.SchDoc: SNES TST Main
size A4; DocumentNumber: 2; SheetNumber: 3; SheetTotal: 7
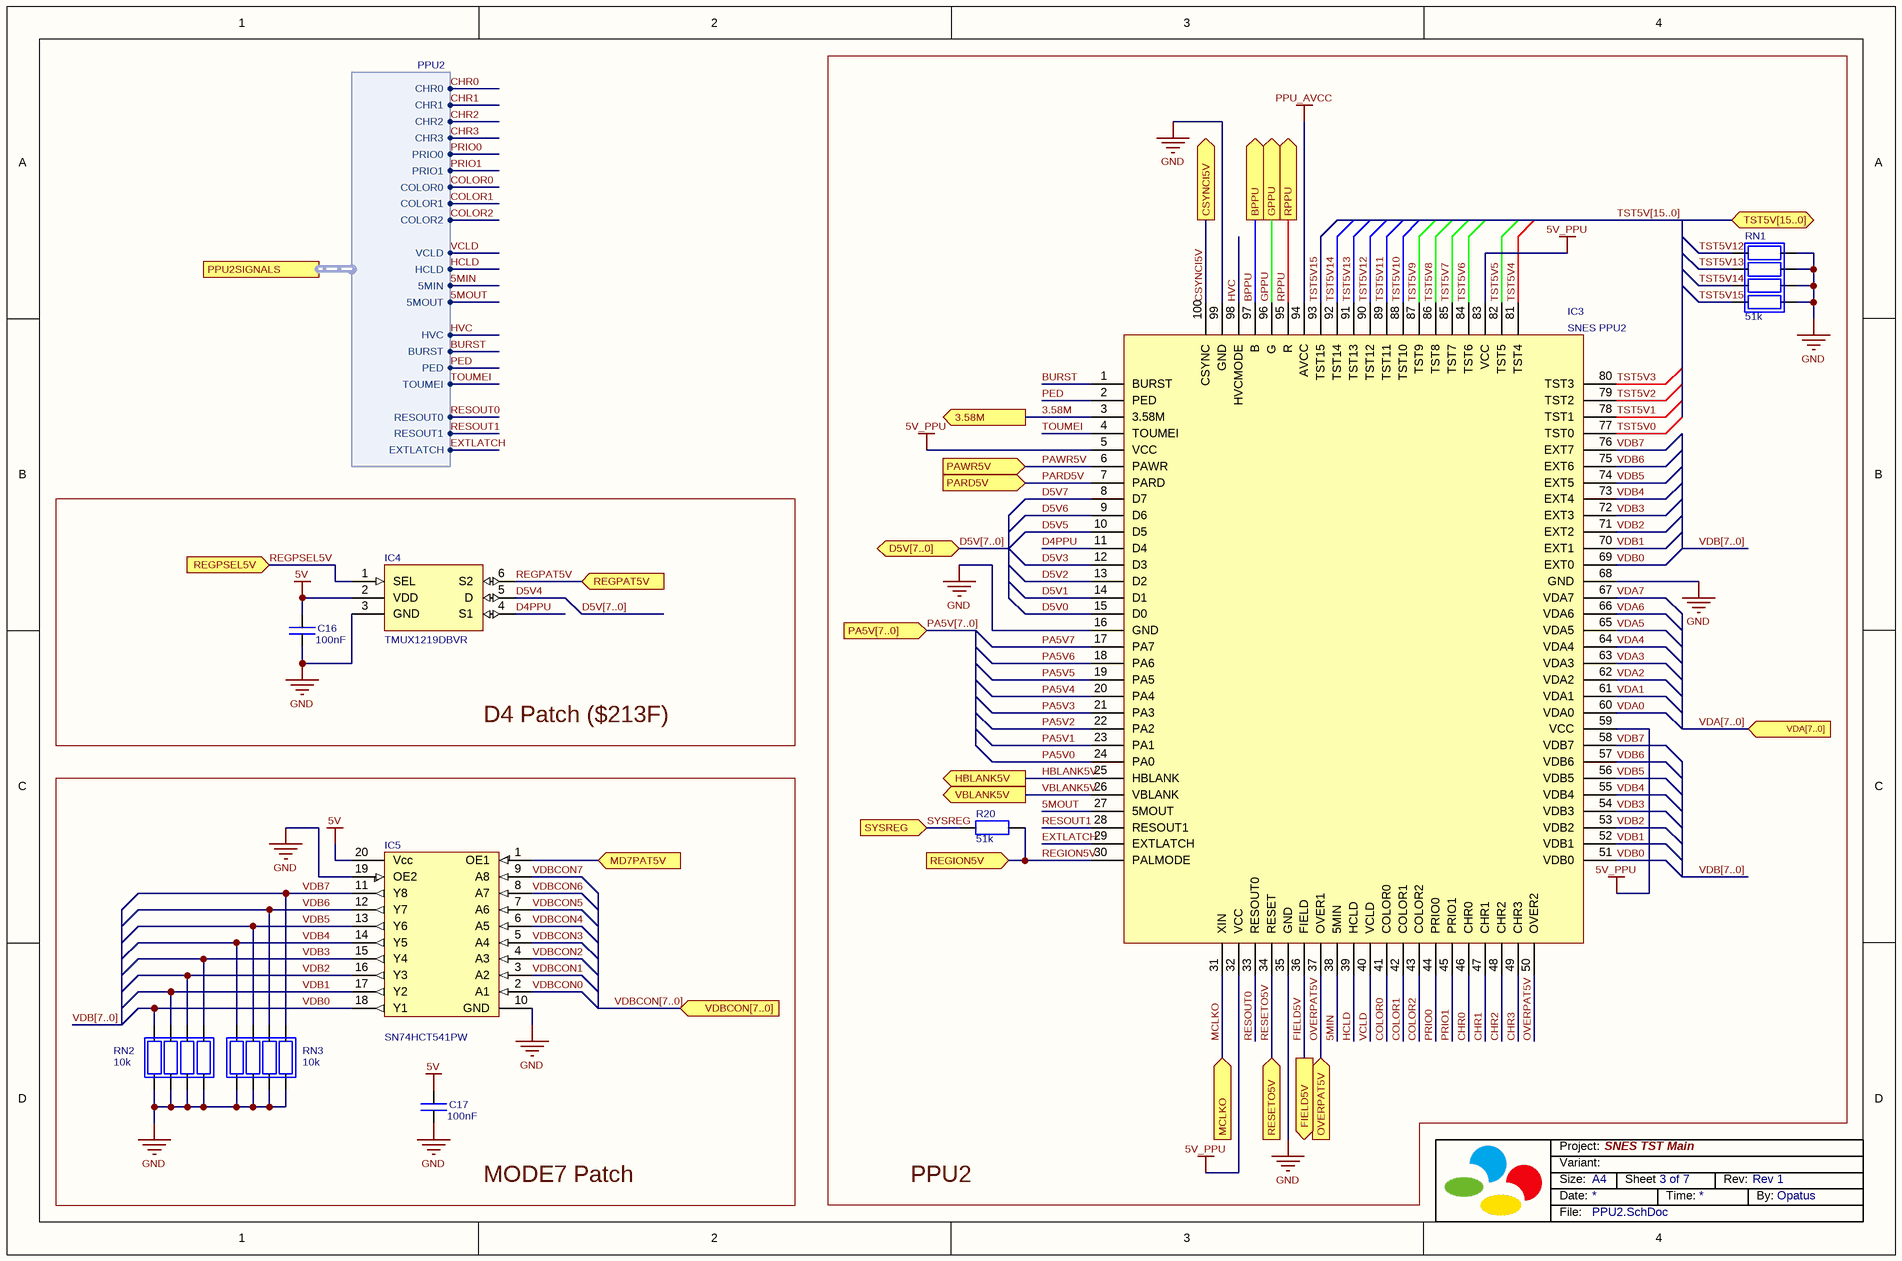
[diagram p3: PPU2.SchDoc]

### Parts
C16  value 100nF  [Cap_0402_Chip]  (hidden comment: Ceramic Capacitor 100nF 10V ±20% X7R 0402)
C17  value 100nF  [Cap_0402_Chip]  (hidden comment: Ceramic Capacitor 100nF 10V ±20% X7R 0402)
IC3  SNES PPU2  [PPU100Pin]  (no BOM)
IC4  Manufacturer_Part_Number: TMUX1219DBVR  [SOT23-6]  (hidden comment: TMUX1219)
IC5  Manufacturer_Part_Number: SN74HCT541PW  [TSSOP20 Narrow]  (hidden comment: SN74HCT541)
R20  value 51k  [Res_0402_Chip]  (hidden comment: Resistor 51k 0402 ±1%)
RN1  value 51k  [1206_Array_Chip]  (hidden comment: Resistor Network 51k 1206 ±1%)
RN2  value 10k  [1206_Array_Chip]  (hidden comment: Resistor Network 10k 1206 ±1%)
RN3  value 10k  [1206_Array_Chip]  (hidden comment: Resistor Network 10k 1206 ±1%)

### Blocks framed on the sheet
PPU2: IC3 R20 RN1
D4 Patch ($213F): C16 IC4
MODE7 Patch: C17 IC5 RN2 RN3

### Ports
3.58M (out), BPPU (out), CSYNCI5V (out), D5V[7..0] (bidir), FIELD5V (out), GPPU (out), HBLANK5V (out), MCLKO (in), MD7PAT5V (in), OVERPAT5V (in), PA5V[7..0] (in), PARD5V (in), PAWR5V (in), PPU2SIGNALS (harness PPU2), REGION5V (in), REGPAT5V (in), REGPSEL5V (in), RESETO5V (in), RPPU (out), SYSREG (in), TST5V[15..0] (bidir), VBLANK5V (out), VDA[7..0] (in), VDBCON[7..0] (in)

### Harnesses
PPU2: CHR0, CHR1, CHR2, CHR3, PRIO0, PRIO1, COLOR0, COLOR1, COLOR2, VCLD, HCLD, 5MIN, 5MOUT, HVC, BURST, PED, TOUMEI, RESOUT0, RESOUT1, EXTLATCH

### Nets
5V: C16.1 C17.1 IC4.2(VDD) IC5.20(Vcc)
5V_PPU: IC3.5(VCC) IC3.32(VCC) IC3.59(VCC) IC3.83(VCC)
GND: C16.2 C17.2 IC3.16(GND) IC3.35(GND) IC3.68(GND) IC3.99(GND) IC4.3(GND) IC5.10(GND) IC5.19(OE2) RN1.1 RN1.2 RN1.3 RN1.4 RN2.1 RN2.2 RN2.3 RN2.4 RN3.1 RN3.2 RN3.3 RN3.4
PPU_AVCC: IC3.94(AVCC)
3.58M: IC3.3(3.58M) ; port 3.58M
5MIN: IC3.38(5MIN) ; port PPU2SIGNALS.5MIN
5MOUT: IC3.27(5MOUT) ; port PPU2SIGNALS.5MOUT
BPPU: IC3.97(B) ; port BPPU
BURST: IC3.1(BURST) ; port PPU2SIGNALS.BURST
CHR0: IC3.46(CHR0) ; port PPU2SIGNALS.CHR0
CHR1: IC3.47(CHR1) ; port PPU2SIGNALS.CHR1
CHR2: IC3.48(CHR2) ; port PPU2SIGNALS.CHR2
CHR3: IC3.49(CHR3) ; port PPU2SIGNALS.CHR3
COLOR0: IC3.41(COLOR0) ; port PPU2SIGNALS.COLOR0
COLOR1: IC3.42(COLOR1) ; port PPU2SIGNALS.COLOR1
COLOR2: IC3.43(COLOR2) ; port PPU2SIGNALS.COLOR2
CSYNCI5V: IC3.100(CSYNC) ; port CSYNCI5V
D4PPU: IC3.11(D4) IC4.4(S1)
D5V0: IC3.15(D0)
D5V1: IC3.14(D1)
D5V2: IC3.13(D2)
D5V3: IC3.12(D3)
D5V4: IC4.5(D)
D5V5: IC3.10(D5)
D5V6: IC3.9(D6)
D5V7: IC3.8(D7)
EXTLATCH: IC3.29(EXTLATCH) ; port PPU2SIGNALS.EXTLATCH
FIELD5V: IC3.36(FIELD) ; port FIELD5V
GPPU: IC3.96(G) ; port GPPU
HBLANK5V: IC3.25(HBLANK) ; port HBLANK5V
HCLD: IC3.39(HCLD) ; port PPU2SIGNALS.HCLD
HVC: IC3.98(HVCMODE) ; port PPU2SIGNALS.HVC
MCLKO: IC3.31(XIN) ; port MCLKO
MD7PAT5V: IC5.1(OE1) ; port MD7PAT5V
OVERPAT5V: IC3.37(OVER1) IC3.50(OVER2) ; port OVERPAT5V
PA5V0: IC3.24(PA0)
PA5V1: IC3.23(PA1)
PA5V2: IC3.22(PA2)
PA5V3: IC3.21(PA3)
PA5V4: IC3.20(PA4)
PA5V5: IC3.19(PA5)
PA5V6: IC3.18(PA6)
PA5V7: IC3.17(PA7)
PARD5V: IC3.7(PARD) ; port PARD5V
PAWR5V: IC3.6(PAWR) ; port PAWR5V
PED: IC3.2(PED) ; port PPU2SIGNALS.PED
PRIO0: IC3.44(PRIO0) ; port PPU2SIGNALS.PRIO0
PRIO1: IC3.45(PRIO1) ; port PPU2SIGNALS.PRIO1
REGION5V: IC3.30(PALMODE) R20.1 ; port REGION5V
REGPAT5V: IC4.6(S2) ; port REGPAT5V
REGPSEL5V: IC4.1(SEL) ; port REGPSEL5V
RESETO5V: IC3.34(RESET) ; port RESETO5V
RESOUT0: IC3.33(RESOUT0) ; port PPU2SIGNALS.RESOUT0
RESOUT1: IC3.28(RESOUT1) ; port PPU2SIGNALS.RESOUT1
RPPU: IC3.95(R) ; port RPPU
SYSREG: R20.2 ; port SYSREG
TOUMEI: IC3.4(TOUMEI) ; port PPU2SIGNALS.TOUMEI
TST5V0: IC3.77(TST0)
TST5V1: IC3.78(TST1)
TST5V2: IC3.79(TST2)
TST5V3: IC3.80(TST3)
TST5V4: IC3.81(TST4)
TST5V5: IC3.82(TST5)
TST5V6: IC3.84(TST6)
TST5V7: IC3.85(TST7)
TST5V8: IC3.86(TST8)
TST5V9: IC3.87(TST9)
TST5V10: IC3.88(TST10)
TST5V11: IC3.89(TST11)
TST5V12: IC3.90(TST12) RN1.5
TST5V13: IC3.91(TST13) RN1.6
TST5V14: IC3.92(TST14) RN1.7
TST5V15: IC3.93(TST15) RN1.8
VBLANK5V: IC3.26(VBLANK) ; port VBLANK5V
VCLD: IC3.40(VCLD) ; port PPU2SIGNALS.VCLD
VDA0: IC3.60(VDA0)
VDA1: IC3.61(VDA1)
VDA2: IC3.62(VDA2)
VDA3: IC3.63(VDA3)
VDA4: IC3.64(VDA4)
VDA5: IC3.65(VDA5)
VDA6: IC3.66(VDA6)
VDA7: IC3.67(VDA7)
VDB0: IC3.51(VDB0) IC3.69(EXT0) IC5.18(Y1) RN2.8
VDB1: IC3.52(VDB1) IC3.70(EXT1) IC5.17(Y2) RN2.7
VDB2: IC3.53(VDB2) IC3.71(EXT2) IC5.16(Y3) RN2.6
VDB3: IC3.54(VDB3) IC3.72(EXT3) IC5.15(Y4) RN2.5
VDB4: IC3.55(VDB4) IC3.73(EXT4) IC5.14(Y5) RN3.8
VDB5: IC3.56(VDB5) IC3.74(EXT5) IC5.13(Y6) RN3.7
VDB6: IC3.57(VDB6) IC3.75(EXT6) IC5.12(Y7) RN3.6
VDB7: IC3.58(VDB7) IC3.76(EXT7) IC5.11(Y8) RN3.5
VDBCON0: IC5.2(A1)
VDBCON1: IC5.3(A2)
VDBCON2: IC5.4(A3)
VDBCON3: IC5.5(A4)
VDBCON4: IC5.6(A5)
VDBCON5: IC5.7(A6)
VDBCON6: IC5.8(A7)
VDBCON7: IC5.9(A8)

### Buses and harness runs
bus D5V[7..0]
bus D5V[7..0] = port D5V[7..0]
bus PA5V[7..0] = port PA5V[7..0]
bus TST5V[15..0] = port TST5V[15..0]
bus VDA[7..0] = port VDA[7..0]
bus VDB[7..0]
bus VDBCON[7..0] = port VDBCON[7..0]

### Notes on the sheet
- Size:
- Date:
- Variant:
- Project:
- A4
- Sheet
- Time:
- Rev:
- By:
- File:

### Library data of the parts
C16 C17 = Capacitor: ChipSize: 0402; NominalVoltage: 10V; Dielectric: X7R; Tolerance: ±20%; PartType: Ceramic Capacitor
IC3 = PPU2100Pin: PPU2; Manufacturer: Nintendo; Manufacturer_Part_Number: PPU2
IC4 = TMUX1219: 2:1 MUX; Manufacturer: Texas Instruments
IC5 = SN74HCT541: Manufacturer: Texas Instruments
R20 = R: ChipSize: 0402; Tolerance: ±1%; PartType: Resistor
RN1-RN3 = RNetwork: ChipSize: 1206; Tolerance: ±1%; PartType: Resistor Network

## Sheet RGB Video Output.SchDoc: SNES TST Main
size A4; DocumentNumber: 4; SheetNumber: 6; SheetTotal: 7
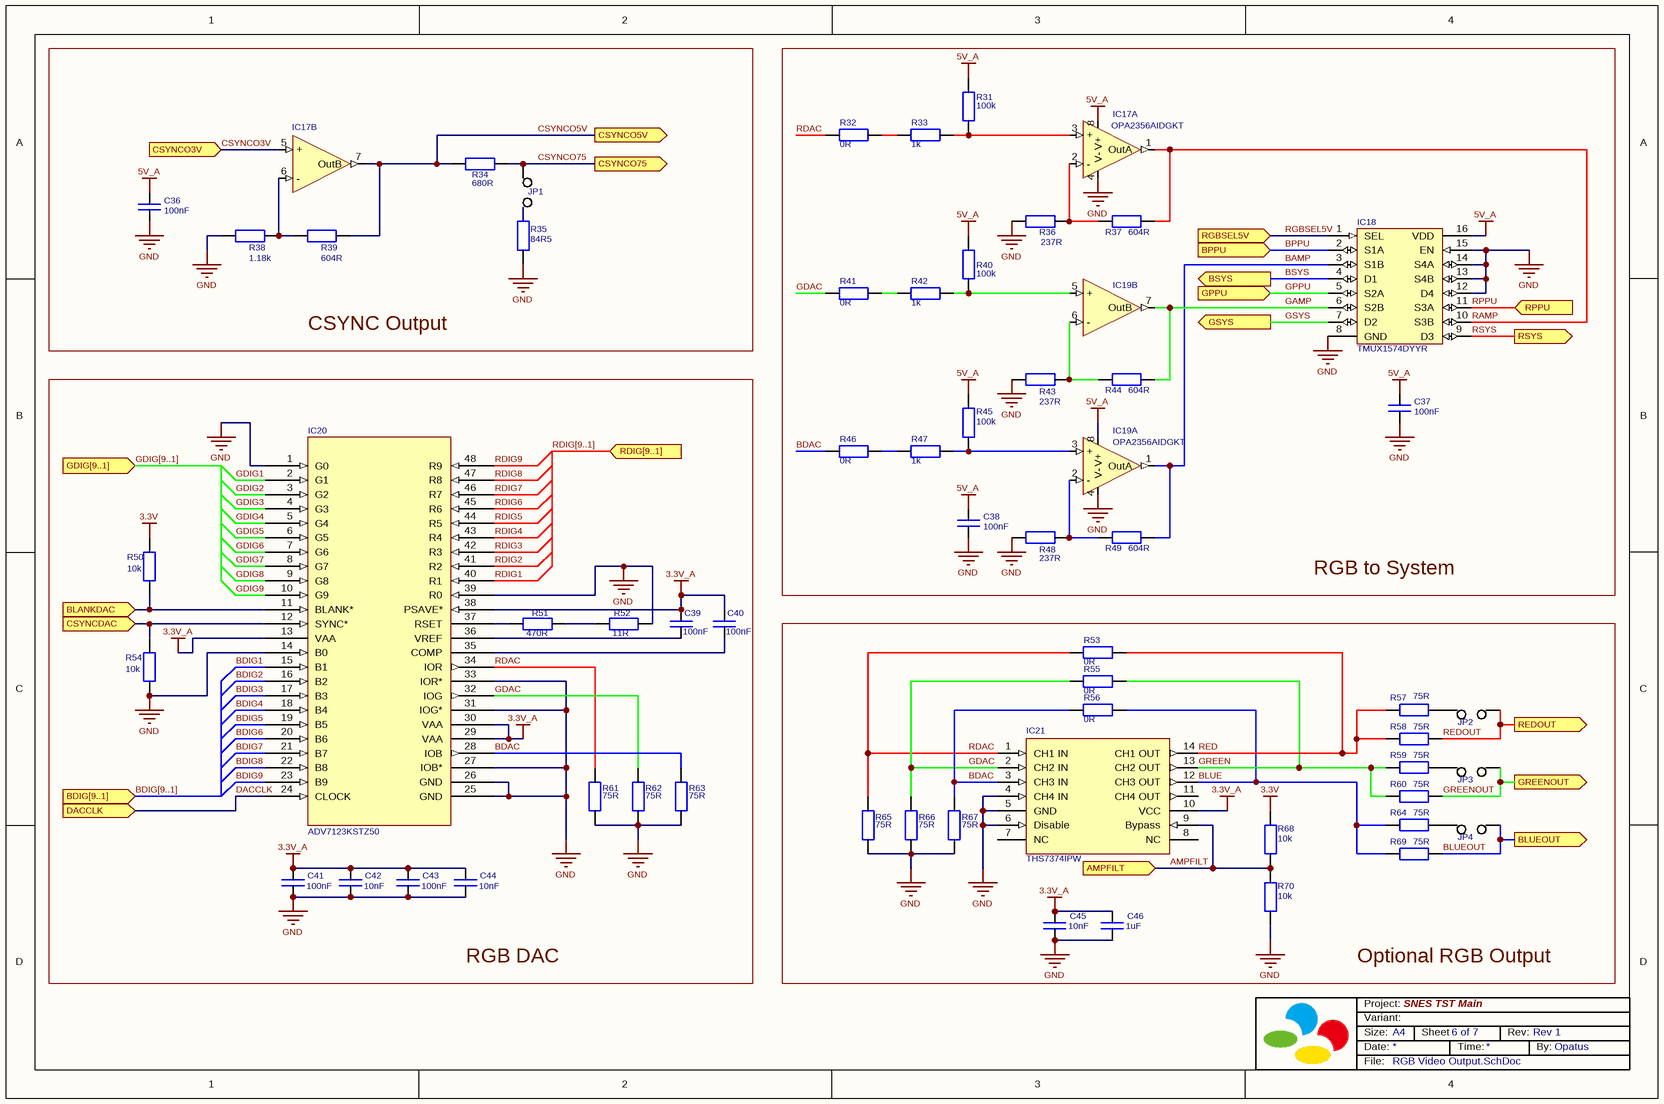
[diagram p4: RGB Video Output.SchDoc]

### Parts
C36  value 100nF  [Cap_0402_Chip]  (hidden comment: Ceramic Capacitor 100nF 10V ±20% X7R 0402)
C37  value 100nF  [Cap_0402_Chip]  (hidden comment: Ceramic Capacitor 100nF 10V ±20% X7R 0402)
C38  value 100nF  [Cap_0402_Chip]  (hidden comment: Ceramic Capacitor 100nF 10V ±20% X7R 0402)
C39  value 100nF  [Cap_0402_Chip]  (hidden comment: Ceramic Capacitor 100nF 10V ±20% X7R 0402)
C40  value 100nF  [Cap_0402_Chip]  (hidden comment: Ceramic Capacitor 100nF 10V ±20% X7R 0402)
C41  value 100nF  [Cap_0402_Chip]  (hidden comment: Ceramic Capacitor 100nF 10V ±20% X7R 0402)
C42  value 10nF  [Cap_0402_Chip]  (hidden comment: Ceramic Capacitor 10nF 10V ±20% X7R 0402)
C43  value 100nF  [Cap_0402_Chip]  (hidden comment: Ceramic Capacitor 100nF 10V ±20% X7R 0402)
C44  value 10nF  [Cap_0402_Chip]  (hidden comment: Ceramic Capacitor 10nF 10V ±20% X7R 0402)
C45  value 10nF  [Cap_0402_Chip]  (hidden comment: Ceramic Capacitor 10nF 10V ±20% X7R 0402)
C46  value 1uF  [Cap_0603_Chip]  (hidden comment: Ceramic Capacitor 1uF 10V ±20% X7R 0603)
IC17  Manufacturer_Part_Number: OPA2356AIDGKT  [MSOP8]  (hidden comment: OPA2356)  (parts A,B of 2)
IC18  Manufacturer_Part_Number: TMUX1574DYYR  [SOT-23THIN16]  (hidden comment: TMUX1574)
IC19  Manufacturer_Part_Number: OPA2356AIDGKT  [MSOP8]  (hidden comment: OPA2356)  (parts A,B of 2)
IC20  Manufacturer_Part_Number: ADV7123KSTZ50  [ST_48_ADI]  (hidden comment: ADV7123)
IC21  Manufacturer_Part_Number: THS7374IPW  [TSSOP14]  (hidden comment: THS7374)
JP1  Jumper  [Jumper]  (value not drawn)  (no BOM)
JP2  Jumper  [Jumper]  (value not drawn)  (no BOM)
JP3  Jumper  [Jumper]  (value not drawn)  (no BOM)
JP4  Jumper  [Jumper]  (value not drawn)  (no BOM)
R31  value 100k  [Res_0402_Chip]  (hidden comment: Resistor 100k 0402 ±1%)
R32  value 0R  [Res_0402_Chip]  (hidden comment: Resistor 0R 0402)
R33  value 1k  [Res_0402_Chip]  (hidden comment: Resistor 1k 0402 ±1%)
R34  value 680R  [Res_0603_Chip]  (hidden comment: Resistor 680R 0603 ±1%)
R35  value 84R5  [Res_0402_Chip]  (hidden comment: Resistor 84R5 0402 ±1%)
R36  value 237R  [Res_0402_Chip]  (hidden comment: Resistor 237R 0402 ±1%)
R37  value 604R  [Res_0402_Chip]  (hidden comment: Resistor 604R 0402 ±1%)
R38  value 1.18k  [Res_0402_Chip]  (hidden comment: Resistor 1.18k 0402 ±1%)
R39  value 604R  [Res_0402_Chip]  (hidden comment: Resistor 604R 0402 ±1%)
R40  value 100k  [Res_0402_Chip]  (hidden comment: Resistor 100k 0402 ±1%)
R41  value 0R  [Res_0402_Chip]  (hidden comment: Resistor 0R 0402)
R42  value 1k  [Res_0402_Chip]  (hidden comment: Resistor 1k 0402 ±1%)
R43  value 237R  [Res_0402_Chip]  (hidden comment: Resistor 237R 0402 ±1%)
R44  value 604R  [Res_0402_Chip]  (hidden comment: Resistor 604R 0402 ±1%)
R45  value 100k  [Res_0402_Chip]  (hidden comment: Resistor 100k 0402 ±1%)
R46  value 0R  [Res_0402_Chip]  (hidden comment: Resistor 0R 0402)
R47  value 1k  [Res_0402_Chip]  (hidden comment: Resistor 1k 0402 ±1%)
R48  value 237R  [Res_0402_Chip]  (hidden comment: Resistor 237R 0402 ±1%)
R49  value 604R  [Res_0402_Chip]  (hidden comment: Resistor 604R 0402 ±1%)
R50  value 10k  [Res_0402_Chip]  (hidden comment: Resistor 10k 0402 ±1%)
R51  value 470R  [Res_0402_Chip]  (hidden comment: Resistor 470R 0402 ±1%)
R52  value 11R  [Res_0402_Chip]  (hidden comment: Resistor 11R 0402 ±1%)
R53  value 0R  [Res_0402_Chip]  (hidden comment: Resistor 0R 0402)
R54  value 10k  [Res_0402_Chip]  (hidden comment: Resistor 10k 0402 ±1%)
R55  value 0R  [Res_0402_Chip]  (hidden comment: Resistor 0R 0402)
R56  value 0R  [Res_0402_Chip]  (hidden comment: Resistor 0R 0402)
R57  value 75R  [Res_0603_Chip]  (hidden comment: Resistor 75R 0603 ±1%)
R58  value 75R  [Res_0603_Chip]  (hidden comment: Resistor 75R 0603 ±1%)
R59  value 75R  [Res_0603_Chip]  (hidden comment: Resistor 75R 0603 ±1%)
R60  value 75R  [Res_0603_Chip]  (hidden comment: Resistor 75R 0603 ±1%)
R61  value 75R  [Res_0402_Chip]  (hidden comment: Resistor 75R 0402 ±1%)
R62  value 75R  [Res_0402_Chip]  (hidden comment: Resistor 75R 0402 ±1%)
R63  value 75R  [Res_0402_Chip]  (hidden comment: Resistor 75R 0402 ±1%)
R64  value 75R  [Res_0603_Chip]  (hidden comment: Resistor 75R 0603 ±1%)
R65  value 75R  [Res_0402_Chip]  (hidden comment: Resistor 75R 0402 ±1%)
R66  value 75R  [Res_0402_Chip]  (hidden comment: Resistor 75R 0402 ±1%)
R67  value 75R  [Res_0402_Chip]  (hidden comment: Resistor 75R 0402 ±1%)
R68  value 10k  [Res_0402_Chip]  (hidden comment: Resistor 10k 0402 ±1%)
R69  value 75R  [Res_0603_Chip]  (hidden comment: Resistor 75R 0603 ±1%)
R70  value 10k  [Res_0402_Chip]  (hidden comment: Resistor 10k 0402 ±1%)

### Blocks framed on the sheet
CSYNC Output: C36 IC17 JP1 R34 R35 R38 R39
RGB to System: C37 C38 IC17-IC19 R31-R33 R36 R37 R40-R49
RGB DAC: C39-C44 IC20 R50-R52 R54 R61-R63
Optional RGB Output: C45 C46 IC21 JP2-JP4 R53 R55-R60 R64-R70

### Ports
AMPFILT (in), BDIG[9..1] (in), BLANKDAC (in), BLUEOUT (out), BPPU (in), BSYS (out), CSYNCDAC (in), CSYNCO3V (in), CSYNCO5V (out), CSYNCO75 (out), DACCLK (in), GDIG[9..1] (in), GPPU (in), GREENOUT (out), GSYS (out), RDIG[9..1] (in), REDOUT (out), RGBSEL5V (in), RPPU (in), RSYS (out)

### Nets
3.3V: R50.2 R68.1
3.3V_A: C39.1 C40.1 C41.2 C42.2 C43.2 C44.2 C45.2 C46.2 IC20.13(VAA) IC20.29(VAA) IC20.30(VAA) IC20.38(PSAVE*) IC21.10(VCC)
5V_A: C36.1 C37.1 C38.1 IC17.8(V+) IC18.16(VDD) IC19.8(V+) R31.2 R40.2 R45.2
GND: C36.2 C37.2 C38.2 C41.1 C42.1 C43.1 C44.1 C45.1 C46.1 IC17.4(V-) IC18.8(GND) IC18.12(D4) IC18.13(S4B) IC18.14(S4A) IC18.15(EN) IC19.4(V-) IC20.1(G0) IC20.14(B0) IC20.25(GND) IC20.26(GND) IC20.27(IOB*) IC20.31(IOG*) IC20.33(IOR*) IC20.39(R0) IC21.4(CH4_IN) IC21.5(GND) IC21.6(Disable) R35.1 R36.1 R38.1 R43.1 R48.2 R52.2 R54.1 R61.1 R62.1 R63.1 R65.1 R66.1 R67.1 R70.2
AMPFILT: IC21.9(Bypass) R68.2 R70.1 ; port AMPFILT
BAMP: IC18.3(S1B) IC19.1(OutA) R49.2
BDAC: IC20.28(IOB) IC21.3(CH3_IN) R46.2 R56.2 R63.2 R67.2
BDIG1: IC20.15(B1)
BDIG2: IC20.16(B2)
BDIG3: IC20.17(B3)
BDIG4: IC20.18(B4)
BDIG5: IC20.19(B5)
BDIG6: IC20.20(B6)
BDIG7: IC20.21(B7)
BDIG8: IC20.22(B8)
BDIG9: IC20.23(B9)
BLANKDAC: IC20.11(BLANK*) R50.1 ; port BLANKDAC
BLUE: IC21.12(CH3_OUT) R56.1 R64.1 R69.1
BLUEOUT: JP4.1 R69.2 ; port BLUEOUT
BPPU: IC18.2(S1A) ; port BPPU
BSYS: IC18.4(D1) ; port BSYS
CSYNCDAC: IC20.12(SYNC*) R54.2 ; port CSYNCDAC
CSYNCO3V: IC17.5(+) ; port CSYNCO3V
CSYNCO5V: IC17.7(OutB) R34.1 R39.1 ; port CSYNCO5V
CSYNCO75: JP1.1 R34.2 ; port CSYNCO75
DACCLK: IC20.24(CLOCK) ; port DACCLK
GAMP: IC18.6(S2B) IC19.7(OutB) R44.1
GDAC: IC20.32(IOG) IC21.2(CH2_IN) R41.2 R55.2 R62.2 R66.2
GDIG1: IC20.2(G1)
GDIG2: IC20.3(G2)
GDIG3: IC20.4(G3)
GDIG4: IC20.5(G4)
GDIG5: IC20.6(G5)
GDIG6: IC20.7(G6)
GDIG7: IC20.8(G7)
GDIG8: IC20.9(G8)
GDIG9: IC20.10(G9)
GPPU: IC18.5(S2A) ; port GPPU
GREEN: IC21.13(CH2_OUT) R55.1 R59.1 R60.1
GREENOUT: JP3.1 R60.2 ; port GREENOUT
GSYS: IC18.7(D2) ; port GSYS
RAMP: IC17.1(OutA) IC18.10(S3B) R37.2
RDAC: IC20.34(IOR) IC21.1(CH1_IN) R32.2 R53.2 R61.2 R65.2
RDIG1: IC20.40(R1)
RDIG2: IC20.41(R2)
RDIG3: IC20.42(R3)
RDIG4: IC20.43(R4)
RDIG5: IC20.44(R5)
RDIG6: IC20.45(R6)
RDIG7: IC20.46(R7)
RDIG8: IC20.47(R8)
RDIG9: IC20.48(R9)
RED: IC21.14(CH1_OUT) R53.1 R57.1 R58.1
REDOUT: JP2.1 R58.2 ; port REDOUT
RGBSEL5V: IC18.1(SEL) ; port RGBSEL5V
RPPU: IC18.11(S3A) ; port RPPU
RSYS: IC18.9(D3) ; port RSYS
NetC39_2: C39.2 IC20.36(VREF)
NetC40_2: C40.2 IC20.35(COMP)
NetIC17_2: IC17.2(-) R36.2 R37.1
NetIC17_3: IC17.3(+) R31.1 R33.1
NetIC17_6: IC17.6(-) R38.2 R39.2
NetIC19_2: IC19.2(-) R48.1 R49.1
NetIC19_3: IC19.3(+) R45.1 R47.1
NetIC19_5: IC19.5(+) R40.1 R42.1
NetIC19_6: IC19.6(-) R43.2 R44.2
NetIC20_37: IC20.37(RSET) R51.1
NetJP1_2: JP1.2 R35.2
NetJP2_2: JP2.2 R57.2
NetJP3_2: JP3.2 R59.2
NetJP4_2: JP4.2 R64.2
NetR32_1: R32.1 R33.2
NetR41_1: R41.1 R42.2
NetR46_1: R46.1 R47.2
NetR51_2: R51.2 R52.1

Not connected (* = marked no-connect by the designer): IC21 7(NC) 8(NC) 11(CH4_OUT)

### Buses and harness runs
bus BDIG[9..1] = port BDIG[9..1]
bus GDIG[9..1] = port GDIG[9..1]
bus RDIG[9..1] = port RDIG[9..1]

### Notes on the sheet
- Size:
- Date:
- Variant:
- Project:
- A4
- Sheet
- Time:
- Rev:
- By:
- File:

### Library data of the parts
C36-C45 = Capacitor: ChipSize: 0402; NominalVoltage: 10V; Dielectric: X7R; Tolerance: ±20%; PartType: Ceramic Capacitor
C46 = Capacitor: ChipSize: 0603; NominalVoltage: 10V; Dielectric: X7R; Tolerance: ±20%; PartType: Ceramic Capacitor
IC17 IC19 = OPA2356: Manufacturer: Texas Instruments
IC18 = TMUX1574: SPDT 4 Ch; Manufacturer: Texas Instruments
IC20 = ADV7123KSTZ140: 10Bit Video DAC; Manufacturer: Analog Devices Inc; Built_By: EMA_UL_Team; SourceLibrary: Analog_2012-01-01_8; Copyright: Copyright (C) 2018 Accelerated Designs. All rights reserved; RefDes: RefDes; Type: DEV
IC21 = THS7374: Manufacturer: Texas Instruments
R31-R33 R35-R56 R61-R63 R65-R68 R70 = R: ChipSize: 0402; PartType: Resistor
  R31 R33 R35-R40 R42-R45 R47-R52 R54 R61-R63 R65-R68 R70: Tolerance: ±1%
R34 R57-R60 R64 R69 = R: ChipSize: 0603; Tolerance: ±1%; PartType: Resistor

## Sheet Voltage Shifters.SchDoc: SNES TST Main
size A4; DocumentNumber: 3; SheetNumber: 5; SheetTotal: 7
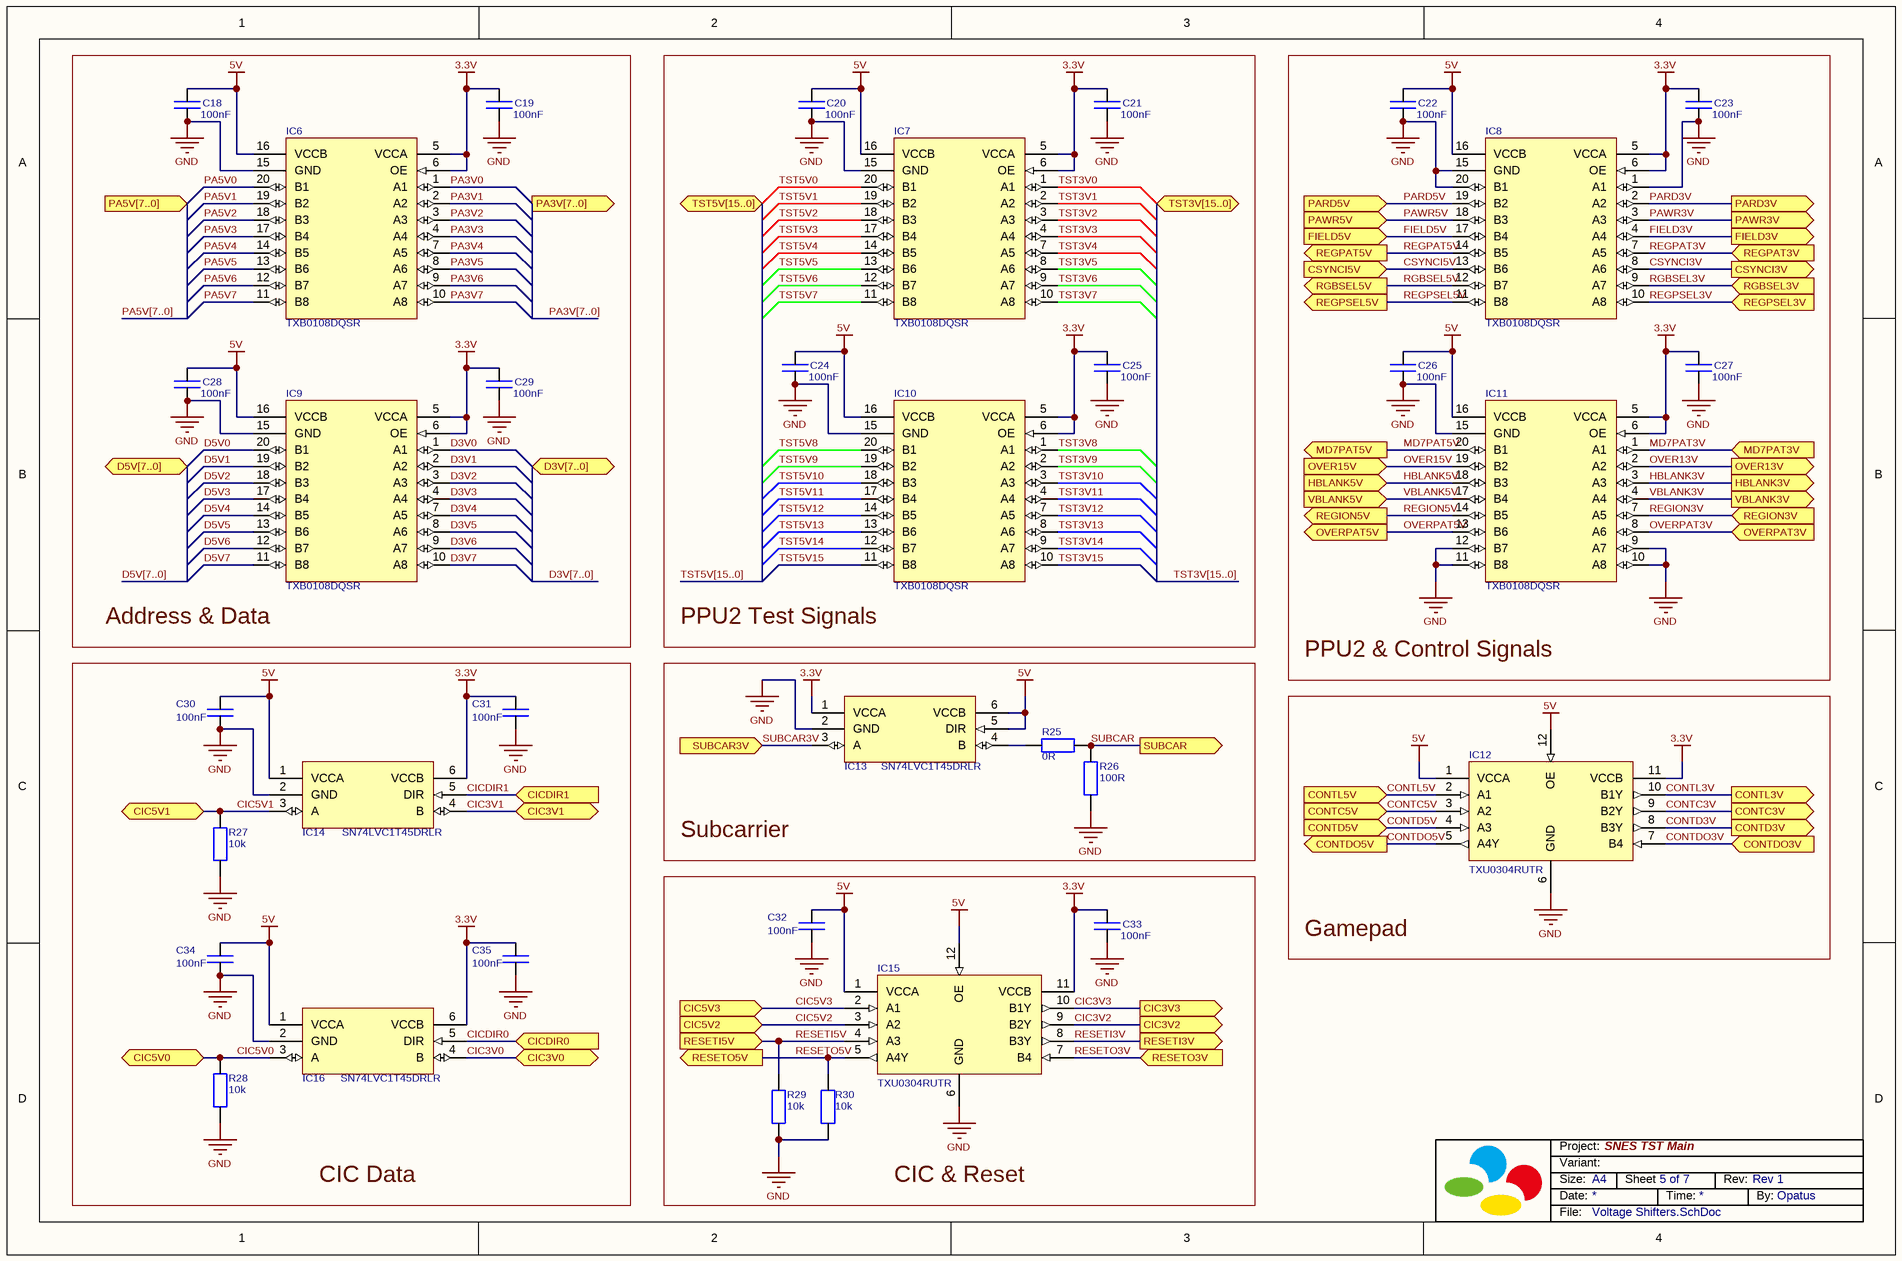
[diagram p5: Voltage Shifters.SchDoc]

### Parts
C18  value 100nF  [Cap_0402_Chip]  (hidden comment: Ceramic Capacitor 100nF 10V ±20% X7R 0402)
C19  value 100nF  [Cap_0402_Chip]  (hidden comment: Ceramic Capacitor 100nF 10V ±20% X7R 0402)
C20  value 100nF  [Cap_0402_Chip]  (hidden comment: Ceramic Capacitor 100nF 10V ±20% X7R 0402)
C21  value 100nF  [Cap_0402_Chip]  (hidden comment: Ceramic Capacitor 100nF 10V ±20% X7R 0402)
C22  value 100nF  [Cap_0402_Chip]  (hidden comment: Ceramic Capacitor 100nF 10V ±20% X7R 0402)
C23  value 100nF  [Cap_0402_Chip]  (hidden comment: Ceramic Capacitor 100nF 10V ±20% X7R 0402)
C24  value 100nF  [Cap_0402_Chip]  (hidden comment: Ceramic Capacitor 100nF 10V ±20% X7R 0402)
C25  value 100nF  [Cap_0402_Chip]  (hidden comment: Ceramic Capacitor 100nF 10V ±20% X7R 0402)
C26  value 100nF  [Cap_0402_Chip]  (hidden comment: Ceramic Capacitor 100nF 10V ±20% X7R 0402)
C27  value 100nF  [Cap_0402_Chip]  (hidden comment: Ceramic Capacitor 100nF 10V ±20% X7R 0402)
C28  value 100nF  [Cap_0402_Chip]  (hidden comment: Ceramic Capacitor 100nF 10V ±20% X7R 0402)
C29  value 100nF  [Cap_0402_Chip]  (hidden comment: Ceramic Capacitor 100nF 10V ±20% X7R 0402)
C30  value 100nF  [Cap_0402_Chip]  (hidden comment: Ceramic Capacitor 100nF 10V ±20% X7R 0402)
C31  value 100nF  [Cap_0402_Chip]  (hidden comment: Ceramic Capacitor 100nF 10V ±20% X7R 0402)
C32  value 100nF  [Cap_0402_Chip]  (hidden comment: Ceramic Capacitor 100nF 10V ±20% X7R 0402)
C33  value 100nF  [Cap_0402_Chip]  (hidden comment: Ceramic Capacitor 100nF 10V ±20% X7R 0402)
C34  value 100nF  [Cap_0402_Chip]  (hidden comment: Ceramic Capacitor 100nF 10V ±20% X7R 0402)
C35  value 100nF  [Cap_0402_Chip]  (hidden comment: Ceramic Capacitor 100nF 10V ±20% X7R 0402)
IC6  TXB0108DQSR  [SON20]
IC7  TXB0108DQSR  [SON20]
IC8  TXB0108DQSR  [SON20]
IC9  TXB0108DQSR  [SON20]
IC10  TXB0108DQSR  [SON20]
IC11  TXB0108DQSR  [SON20]
IC12  Manufacturer_Part_Number: TXU0304RUTR  [UQFN12]  (hidden comment: TXU0304)
IC13  Manufacturer_Part_Number: SN74LVC1T45DRLR  [SOT-5X3]  (hidden comment: SN74LVC1T45)
IC14  Manufacturer_Part_Number: SN74LVC1T45DRLR  [SOT-5X3]  (hidden comment: SN74LVC1T45)
IC15  Manufacturer_Part_Number: TXU0304RUTR  [UQFN12]  (hidden comment: TXU0304)
IC16  Manufacturer_Part_Number: SN74LVC1T45DRLR  [SOT-5X3]  (hidden comment: SN74LVC1T45)
R25  value 0R  [Res_0603_Chip]  (hidden comment: Resistor 0R 0603 ±1%)
R26  value 100R  [Res_0603_Chip]  (hidden comment: Resistor 100R 0603 ±1%)
R27  value 10k  [Res_0402_Chip]  (hidden comment: Resistor 10k 0402 ±1%)
R28  value 10k  [Res_0402_Chip]  (hidden comment: Resistor 10k 0402 ±1%)
R29  value 10k  [Res_0402_Chip]  (hidden comment: Resistor 10k 0402 ±1%)
R30  value 10k  [Res_0402_Chip]  (hidden comment: Resistor 10k 0402 ±1%)

### Blocks framed on the sheet
Address & Data: C18 C19 C28 C29 IC6 IC9
PPU2 Test Signals: C20 C21 C24 C25 IC7 IC10
PPU2 & Control Signals: C22 C23 C26 C27 IC8 IC11
CIC Data: C30 C31 C34 C35 IC14 IC16 R27 R28
Subcarrier: IC13 R25 R26
Gamepad: IC12
CIC & Reset: C32 C33 IC15 R29 R30

### Ports
CIC3V0 (bidir), CIC3V1 (bidir), CIC3V2 (out), CIC3V3 (out), CIC5V0 (bidir), CIC5V1 (bidir), CIC5V2 (in), CIC5V3 (in), CICDIR0 (in), CICDIR1 (in), CONTC3V (out), CONTC5V (in), CONTD3V (out), CONTD5V (in), CONTDO3V (in), CONTDO5V (out), CONTL3V (out), CONTL5V (in), CSYNCI3V (out), CSYNCI5V (in), D3V[7..0] (bidir), D5V[7..0] (bidir), FIELD3V (out), FIELD5V (in), HBLANK3V (out), HBLANK5V (in), MD7PAT3V (in), MD7PAT5V (out), OVER13V (out), OVER15V (in), OVERPAT3V (in), OVERPAT5V (out), PA3V[7..0] (out), PA5V[7..0] (in), PARD3V (out), PARD5V (in), PAWR3V (out), PAWR5V (in), REGION3V (in), REGION5V (out), REGPAT3V (in), REGPAT5V (out), REGPSEL3V (in), REGPSEL5V (out), RESETI3V (out), RESETI5V (in), RESETO3V (in), RESETO5V (out), RGBSEL3V (in), RGBSEL5V (out), SUBCAR3V (in), SUBCAR (out), TST3V[15..0] (bidir), TST5V[15..0] (bidir), VBLANK3V (out), VBLANK5V (in)

### Nets
3.3V: C19.1 C21.1 C23.1 C25.1 C27.1 C29.1 C31.1 C33.1 C35.1 IC6.5(VCCA) IC6.6(OE) IC7.5(VCCA) IC7.6(OE) IC8.5(VCCA) IC8.6(OE) IC9.5(VCCA) IC9.6(OE) IC10.5(VCCA) IC10.6(OE) IC11.5(VCCA) IC11.6(OE) IC12.11(VCCB) IC13.1(VCCA) IC14.6(VCCB) IC15.11(VCCB) IC16.6(VCCB)
5V: C18.1 C20.1 C22.1 C24.1 C26.1 C28.1 C30.1 C32.1 C34.1 IC6.16(VCCB) IC7.16(VCCB) IC8.16(VCCB) IC9.16(VCCB) IC10.16(VCCB) IC11.16(VCCB) IC12.1(VCCA) IC12.12(OE) IC13.5(DIR) IC13.6(VCCB) IC14.1(VCCA) IC15.1(VCCA) IC15.12(OE) IC16.1(VCCA)
GND: C18.2 C19.2 C20.2 C21.2 C22.2 C23.2 C24.2 C25.2 C26.2 C27.2 C28.2 C29.2 C30.2 C31.2 C32.2 C33.2 C34.2 C35.2 IC6.15(GND) IC7.15(GND) IC8.1(A1) IC8.15(GND) IC8.20(B1) IC9.15(GND) IC10.15(GND) IC11.9(A7) IC11.10(A8) IC11.11(B8) IC11.12(B7) IC11.15(GND) IC12.6(GND) IC13.2(GND) IC14.2(GND) IC15.6(GND) IC16.2(GND) R26.2 R27.1 R28.1 R29.2 R30.1
CIC3V0: IC16.4(B) ; port CIC3V0
CIC3V1: IC14.4(B) ; port CIC3V1
CIC3V2: IC15.9(B2Y) ; port CIC3V2
CIC3V3: IC15.10(B1Y) ; port CIC3V3
CIC5V0: IC16.3(A) R28.2 ; port CIC5V0
CIC5V1: IC14.3(A) R27.2 ; port CIC5V1
CIC5V2: IC15.3(A2) ; port CIC5V2
CIC5V3: IC15.2(A1) ; port CIC5V3
CICDIR0: IC16.5(DIR) ; port CICDIR0
CICDIR1: IC14.5(DIR) ; port CICDIR1
CONTC3V: IC12.9(B2Y) ; port CONTC3V
CONTC5V: IC12.3(A2) ; port CONTC5V
CONTD3V: IC12.8(B3Y) ; port CONTD3V
CONTD5V: IC12.4(A3) ; port CONTD5V
CONTDO3V: IC12.7(B4) ; port CONTDO3V
CONTDO5V: IC12.5(A4Y) ; port CONTDO5V
CONTL3V: IC12.10(B1Y) ; port CONTL3V
CONTL5V: IC12.2(A1) ; port CONTL5V
CSYNCI3V: IC8.8(A6) ; port CSYNCI3V
CSYNCI5V: IC8.13(B6) ; port CSYNCI5V
D3V0: IC9.1(A1)
D3V1: IC9.2(A2)
D3V2: IC9.3(A3)
D3V3: IC9.4(A4)
D3V4: IC9.7(A5)
D3V5: IC9.8(A6)
D3V6: IC9.9(A7)
D3V7: IC9.10(A8)
D5V0: IC9.20(B1)
D5V1: IC9.19(B2)
D5V2: IC9.18(B3)
D5V3: IC9.17(B4)
D5V4: IC9.14(B5)
D5V5: IC9.13(B6)
D5V6: IC9.12(B7)
D5V7: IC9.11(B8)
FIELD3V: IC8.4(A4) ; port FIELD3V
FIELD5V: IC8.17(B4) ; port FIELD5V
HBLANK3V: IC11.3(A3) ; port HBLANK3V
HBLANK5V: IC11.18(B3) ; port HBLANK5V
MD7PAT3V: IC11.1(A1) ; port MD7PAT3V
MD7PAT5V: IC11.20(B1) ; port MD7PAT5V
OVER13V: IC11.2(A2) ; port OVER13V
OVER15V: IC11.19(B2) ; port OVER15V
OVERPAT3V: IC11.8(A6) ; port OVERPAT3V
OVERPAT5V: IC11.13(B6) ; port OVERPAT5V
PA3V0: IC6.1(A1)
PA3V1: IC6.2(A2)
PA3V2: IC6.3(A3)
PA3V3: IC6.4(A4)
PA3V4: IC6.7(A5)
PA3V5: IC6.8(A6)
PA3V6: IC6.9(A7)
PA3V7: IC6.10(A8)
PA5V0: IC6.20(B1)
PA5V1: IC6.19(B2)
PA5V2: IC6.18(B3)
PA5V3: IC6.17(B4)
PA5V4: IC6.14(B5)
PA5V5: IC6.13(B6)
PA5V6: IC6.12(B7)
PA5V7: IC6.11(B8)
PARD3V: IC8.2(A2) ; port PARD3V
PARD5V: IC8.19(B2) ; port PARD5V
PAWR3V: IC8.3(A3) ; port PAWR3V
PAWR5V: IC8.18(B3) ; port PAWR5V
REGION3V: IC11.7(A5) ; port REGION3V
REGION5V: IC11.14(B5) ; port REGION5V
REGPAT3V: IC8.7(A5) ; port REGPAT3V
REGPAT5V: IC8.14(B5) ; port REGPAT5V
REGPSEL3V: IC8.10(A8) ; port REGPSEL3V
REGPSEL5V: IC8.11(B8) ; port REGPSEL5V
RESETI3V: IC15.8(B3Y) ; port RESETI3V
RESETI5V: IC15.4(A3) R29.1 ; port RESETI5V
RESETO3V: IC15.7(B4) ; port RESETO3V
RESETO5V: IC15.5(A4Y) R30.2 ; port RESETO5V
RGBSEL3V: IC8.9(A7) ; port RGBSEL3V
RGBSEL5V: IC8.12(B7) ; port RGBSEL5V
SUBCAR: R25.1 R26.1 ; port SUBCAR
SUBCAR3V: IC13.3(A) ; port SUBCAR3V
TST3V0: IC7.1(A1)
TST3V1: IC7.2(A2)
TST3V2: IC7.3(A3)
TST3V3: IC7.4(A4)
TST3V4: IC7.7(A5)
TST3V5: IC7.8(A6)
TST3V6: IC7.9(A7)
TST3V7: IC7.10(A8)
TST3V8: IC10.1(A1)
TST3V9: IC10.2(A2)
TST3V10: IC10.3(A3)
TST3V11: IC10.4(A4)
TST3V12: IC10.7(A5)
TST3V13: IC10.8(A6)
TST3V14: IC10.9(A7)
TST3V15: IC10.10(A8)
TST5V0: IC7.20(B1)
TST5V1: IC7.19(B2)
TST5V2: IC7.18(B3)
TST5V3: IC7.17(B4)
TST5V4: IC7.14(B5)
TST5V5: IC7.13(B6)
TST5V6: IC7.12(B7)
TST5V7: IC7.11(B8)
TST5V8: IC10.20(B1)
TST5V9: IC10.19(B2)
TST5V10: IC10.18(B3)
TST5V11: IC10.17(B4)
TST5V12: IC10.14(B5)
TST5V13: IC10.13(B6)
TST5V14: IC10.12(B7)
TST5V15: IC10.11(B8)
VBLANK3V: IC11.4(A4) ; port VBLANK3V
VBLANK5V: IC11.17(B4) ; port VBLANK5V
NetIC13_4: IC13.4(B) R25.2

### Buses and harness runs
bus D3V[7..0] = port D3V[7..0]
bus D5V[7..0] = port D5V[7..0]
bus PA3V[7..0] = port PA3V[7..0]
bus PA5V[7..0] = port PA5V[7..0]
bus TST3V[15..0] = port TST3V[15..0]
bus TST5V[15..0] = port TST5V[15..0]

### Notes on the sheet
- Size:
- Date:
- Variant:
- Project:
- A4
- Sheet
- Time:
- Rev:
- By:
- File:

### Library data of the parts
C18-C35 = Capacitor: ChipSize: 0402; NominalVoltage: 10V; Dielectric: X7R; Tolerance: ±20%; PartType: Ceramic Capacitor
IC6-IC11 = TXB0108DQSR: 8-bit level shifter; Manufacturer: Texas Instruments; Manufacturer_Part_Number: TXB0108DQSR
IC12 IC15 = TXU0304: 4-bit level shifter; Manufacturer: Texas Instruments
IC13 IC14 IC16 = SN74LVC1T45: 1-bit Transceiver; Manufacturer: Texas Instruments
R25 R26 = R: ChipSize: 0603; Tolerance: ±1%; PartType: Resistor
R27-R30 = R: ChipSize: 0402; Tolerance: ±1%; PartType: Resistor